# EAGLE design mainBoard (EAGLE 9.6.2)

## Sheet 1 of 6
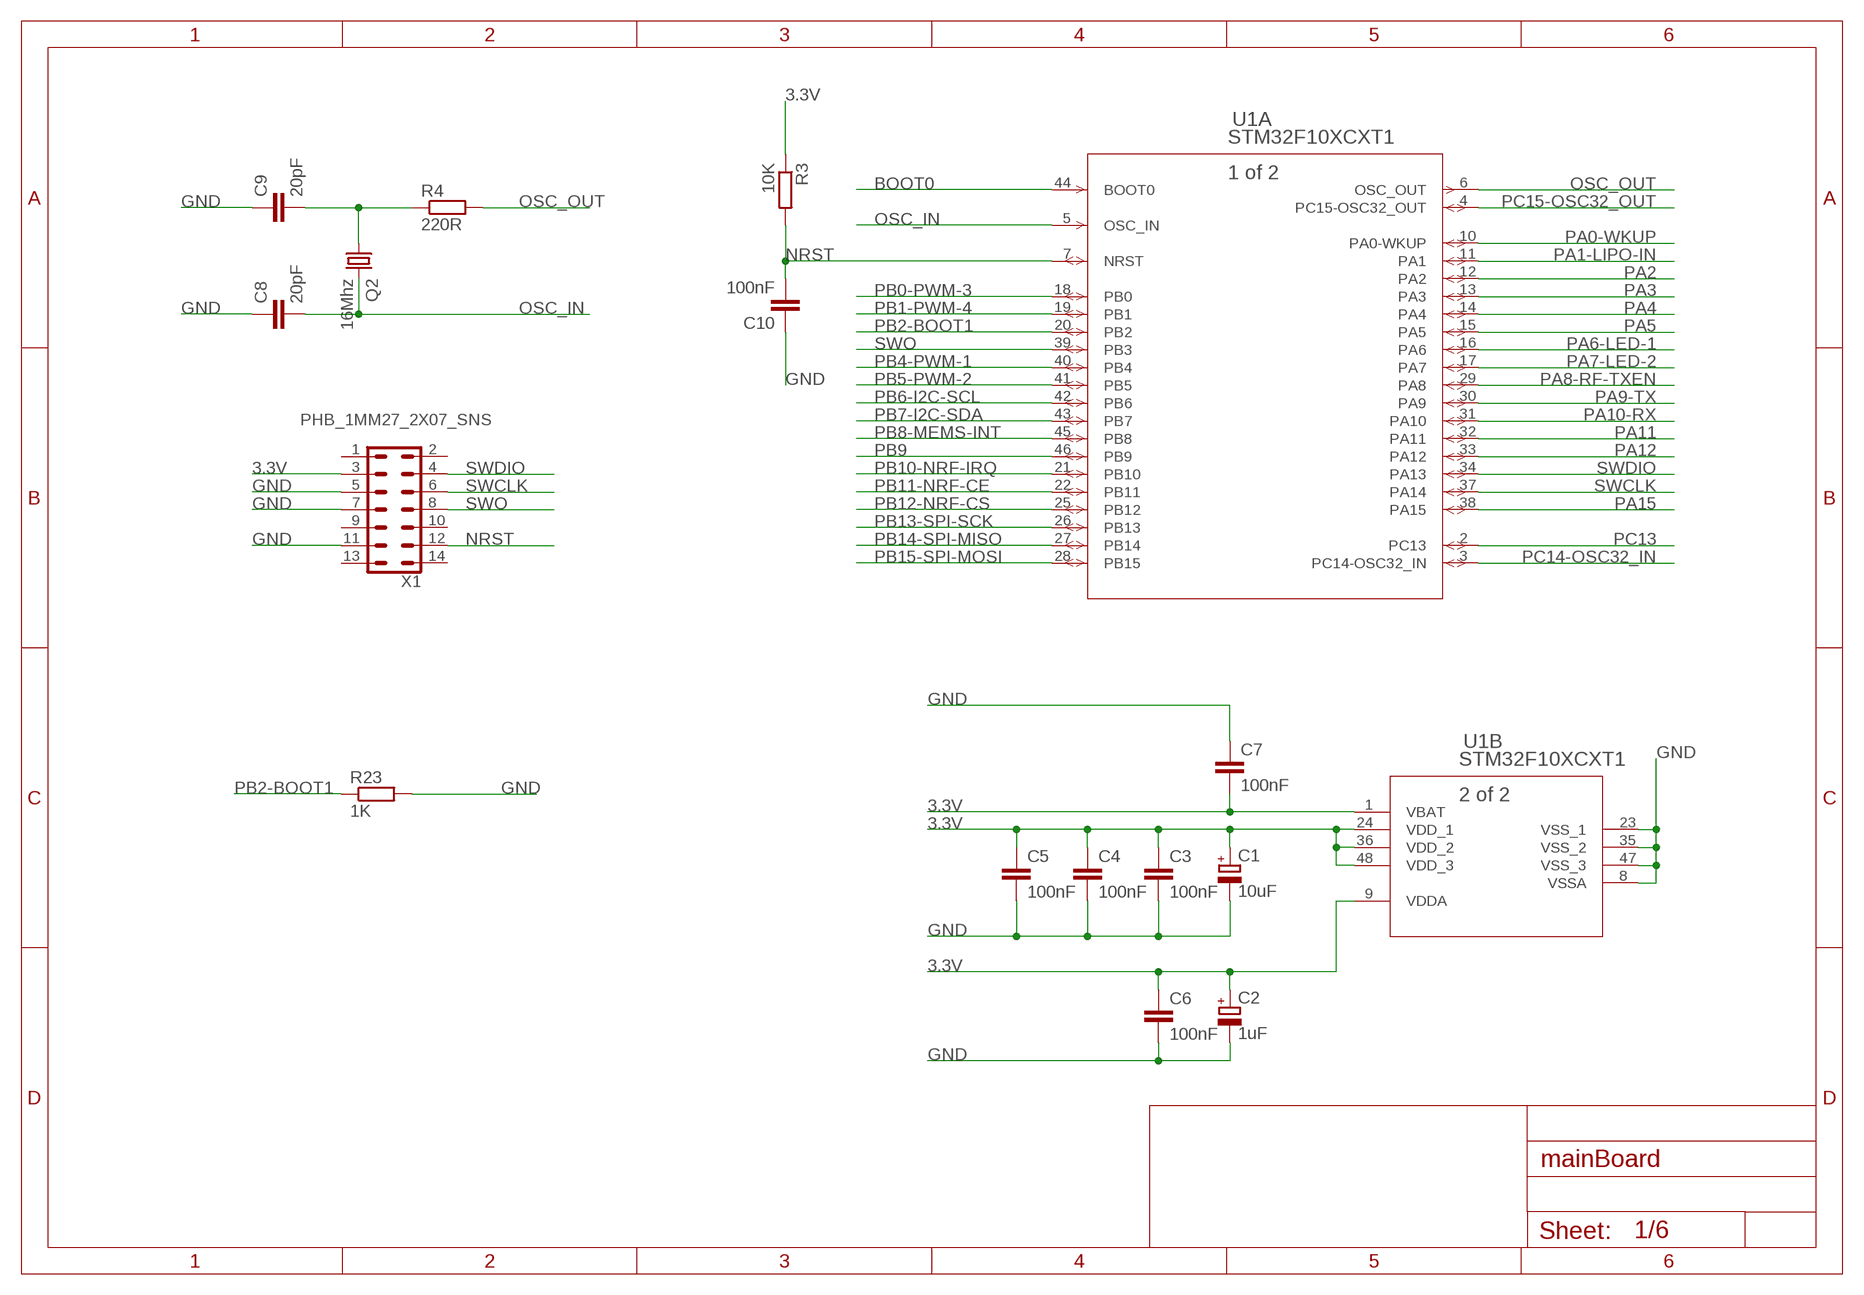
[diagram p0: schematic, sheet 1]

### Parts
C1  10uF  CPOL-EUSMCA  [SMC_A]
C2  1uF  CPOL-EUSMCA  [SMC_A]
C3  100nF  C-EUC0805  [C0805]
C4  100nF  C-EUC0805  [C0805]
C5  100nF  C-EUC0805  [C0805]
C6  100nF  C-EUC0805  [C0805]
C7  100nF  C-EUC0805  [C0805]
C8  20pF  C-EUC0805  [C0805]
C9  20pF  C-EUC0805  [C0805]
C10  100nF  C-EUC0805  [C0805]
Q2  16Mhz  CRYSTALHC49S  [HC49/S]
R3  10K  R-EU_R0805  [R0805]
R4  220R  R-EU_R0805  [R0805]
R23  1K  R-EU_R0805  [R0805]
U1  STM32F10XCXT1  [LQFP48-7X7MM]
X1  PHB_1MM27_2X07_SNS  [PHB_1MM27_2X07_SNS]

### Nets
3.3V: C1.+ C2.+ C3.1 C4.1 C5.1 C6.1 C7.2 R3.1 U1.1(B:VBAT) U1.9(B:VDDA) U1.24(B:VDD_1) U1.36(B:VDD_2) U1.48(B:VDD_3) X1.3 ; also sheet 2,3,4,5,6
BOOT0: U1.44(A:BOOT0) ; also sheet 2
GND: C1.- C2.- C3.2 C4.2 C5.2 C6.2 C7.1 C8.1 C9.1 C10.1 R23.2 U1.8(B:VSSA) U1.23(B:VSS_1) U1.35(B:VSS_2) U1.47(B:VSS_3) X1.5 X1.7 X1.11 ; also sheet 2,3,4,5,6
N$5: C9.2 Q2.1 R4.1
NRST: C10.2 R3.2 U1.7(A:NRST) X1.12 ; also sheet 2
OSC_IN: C8.2 Q2.2 U1.5(A:OSC_IN)
OSC_OUT: R4.2 U1.6(A:OSC_OUT)
PA0-WKUP: U1.10(A:PA0-WKUP)
PA1-LIPO-IN: U1.11(A:PA1) ; also sheet 6
PA2: U1.12(A:PA2)
PA3: U1.13(A:PA3)
PA4: U1.14(A:PA4)
PA5: U1.15(A:PA5)
PA6-LED-1: U1.16(A:PA6) ; also sheet 6
PA7-LED-2: U1.17(A:PA7) ; also sheet 6
PA8-RF-TXEN: U1.29(A:PA8) ; also sheet 3
PA9-TX: U1.30(A:PA9) ; also sheet 2
PA10-RX: U1.31(A:PA10) ; also sheet 2
PA11: U1.32(A:PA11)
PA12: U1.33(A:PA12)
PA15: U1.38(A:PA15)
PB0-PWM-3: U1.18(A:PB0) ; also sheet 6
PB1-PWM-4: U1.19(A:PB1) ; also sheet 6
PB2-BOOT1: R23.1 U1.20(A:PB2)
PB4-PWM-1: U1.40(A:PB4) ; also sheet 6
PB5-PWM-2: U1.41(A:PB5) ; also sheet 6
PB6-I2C-SCL: U1.42(A:PB6) ; also sheet 4,5
PB7-I2C-SDA: U1.43(A:PB7) ; also sheet 4,5
PB8-MEMS-INT: U1.45(A:PB8) ; also sheet 4
PB9: U1.46(A:PB9)
PB10-NRF-IRQ: U1.21(A:PB10) ; also sheet 3
PB11-NRF-CE: U1.22(A:PB11) ; also sheet 3
PB12-NRF-CS: U1.25(A:PB12) ; also sheet 3
PB13-SPI-SCK: U1.26(A:PB13) ; also sheet 3
PB14-SPI-MISO: U1.27(A:PB14) ; also sheet 3
PB15-SPI-MOSI: U1.28(A:PB15) ; also sheet 3
PC13: U1.2(A:PC13)
PC14-OSC32_IN: U1.3(A:PC14-OSC32_IN)
PC15-OSC32_OUT: U1.4(A:PC15-OSC32_OUT)
SWCLK: U1.37(A:PA14) X1.6
SWDIO: U1.34(A:PA13) X1.4
SWO: U1.39(A:PB3) X1.8
Unconnected: X1.1 X1.2 X1.9 X1.10 X1.13 X1.14

## Sheet 2 of 6
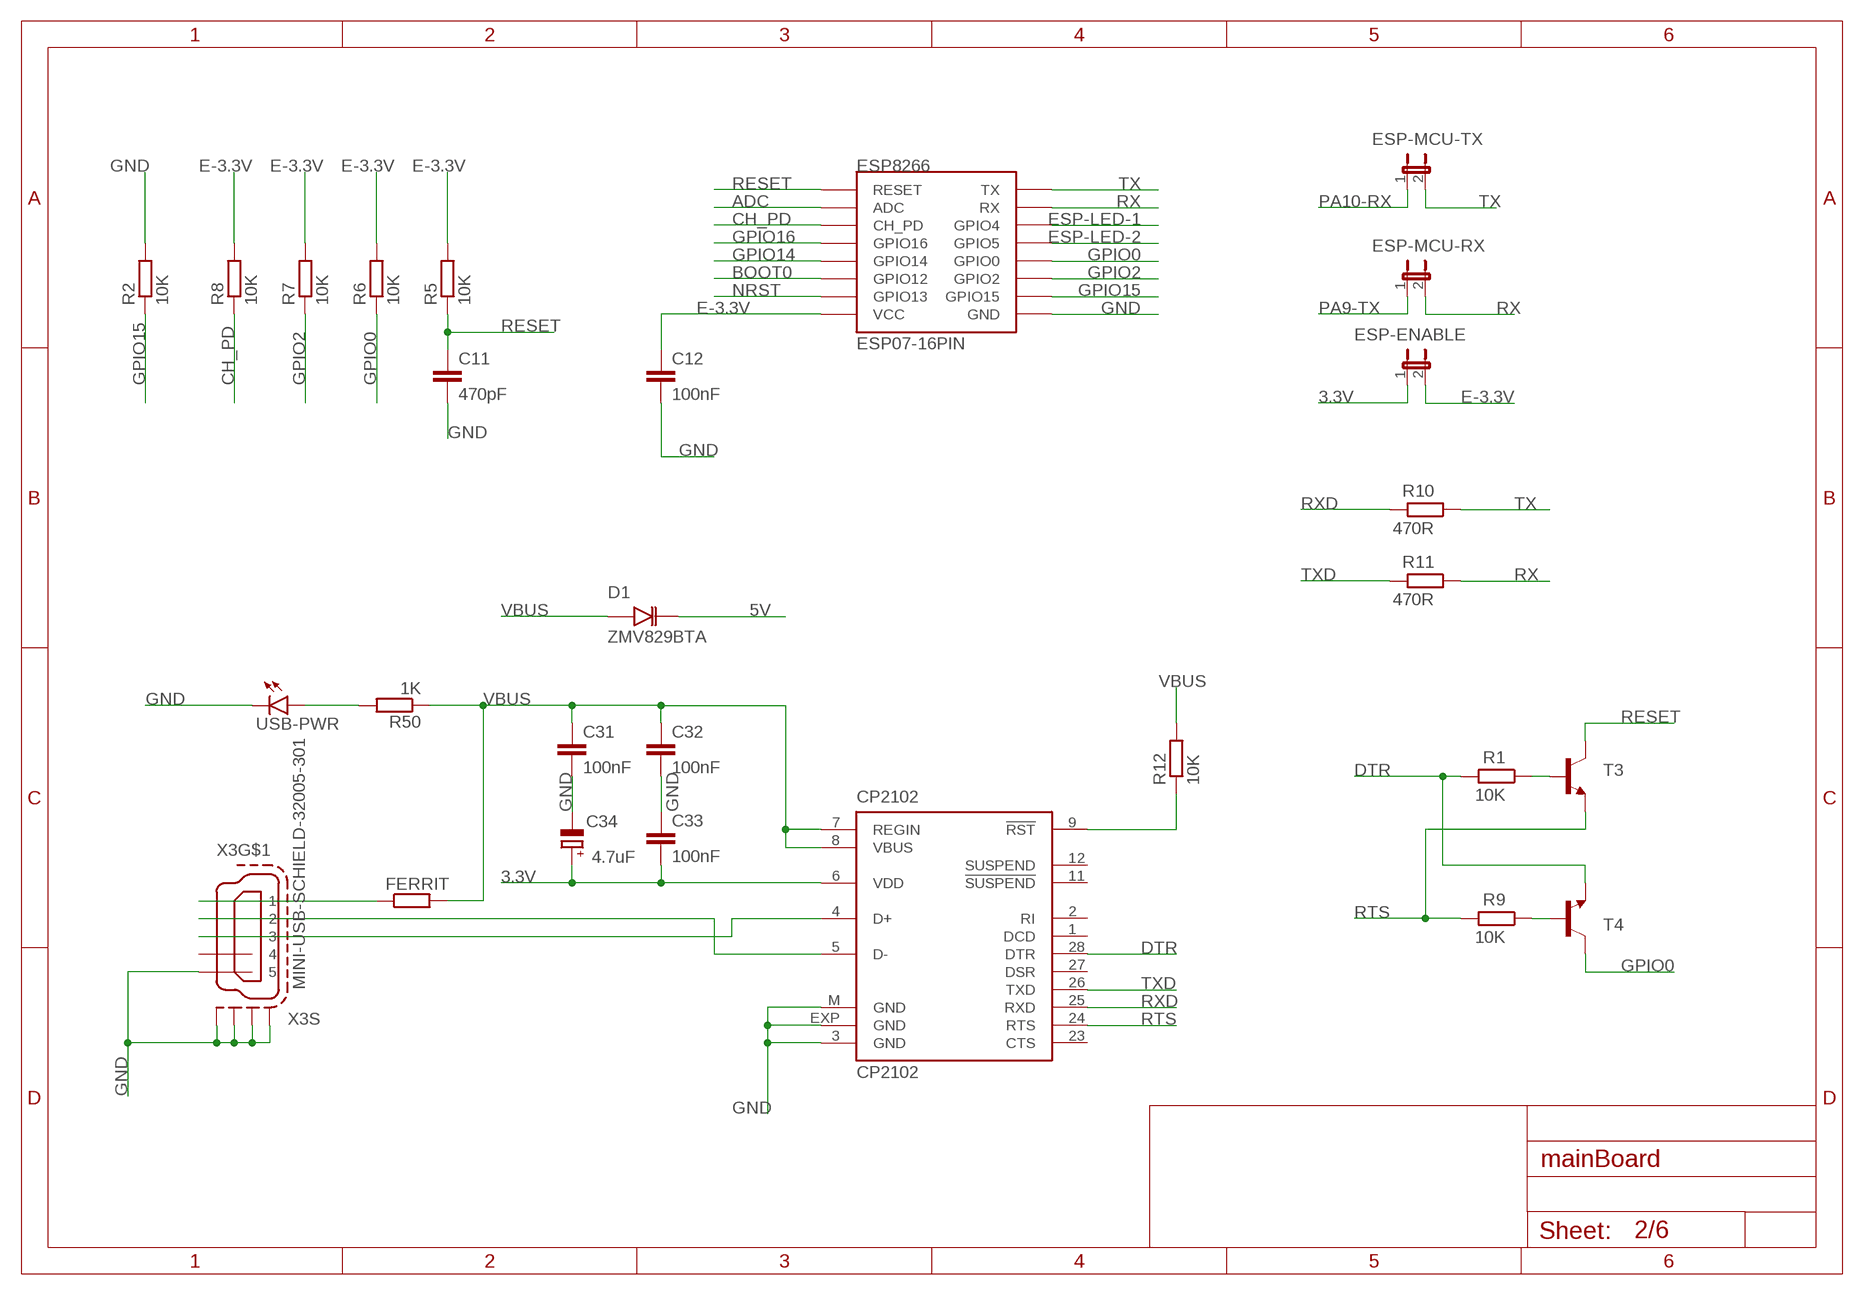
[diagram p1: schematic, sheet 2]

### Parts
C11  470pF  C-EUC0805  [C0805]
C12  100nF  C-EUC0805  [C0805]
C31  100nF  C-EUC0805  [C0805]
C32  100nF  C-EUC0805  [C0805]
C33  100nF  C-EUC0805  [C0805]
C34  4.7uF  CPOL-EUSMCA  [SMC_A]
CP2102  CP2102  [MLP28]
D1  ZMV829BTA  [SOD2512X116N]
ESP8266  ESP07-16PIN  [ESP07-16PIN]
ESP-ENABLE  JP1E  [JP1]
ESP-MCU-RX  JP1E  [JP1]
ESP-MCU-TX  JP1E  [JP1]
FERRIT  R-EU_R0805  [R0805]
R1  10K  R-EU_R0805  [R0805]
R2  10K  R-EU_R0805  [R0805]
R5  10K  R-EU_R0805  [R0805]
R6  10K  R-EU_R0805  [R0805]
R7  10K  R-EU_R0805  [R0805]
R8  10K  R-EU_R0805  [R0805]
R9  10K  R-EU_R0805  [R0805]
R10  470R  R-EU_R0805  [R0805]
R11  470R  R-EU_R0805  [R0805]
R12  10K  R-EU_R0805  [R0805]
R50  1K  R-EU_R0805  [R0805]
T3  -NPN-SOT23-EBC  [SOT23-EBC]
T4  -NPN-SOT23-EBC  [SOT23-EBC]
USB-PWR  LEDCHIPLED_0805  [CHIPLED_0805]
X3  MINI-USB-SCHIELD-32005-301  [32005-301]

### Nets
3.3V: C33.2 C34.+ CP2102.6(VDD) ESP-ENABLE.1 ; also sheet 1,3,4,5,6
5V: D1.K ; also sheet 6
ADC: ESP8266.ADC
BOOT0: ESP8266.GPIO12 ; also sheet 1
CH_PD: ESP8266.CH_PD R8.1
DTR: CP2102.28(DTR) R1.2 T4.E
E-3.3V: C12.1 ESP8266.VCC ESP-ENABLE.2 R5.2 R6.2 R7.2 R8.2
ESP-LED-1: ESP8266.GPIO4 ; also sheet 6
ESP-LED-2: ESP8266.GPIO5 ; also sheet 6
GND: C11.2 C12.2 C31.2 C32.2 C33.1 C34.- CP2102.3(GND) CP2102.EXP(GND) CP2102.M(GND) ESP8266.GND R2.2 USB-PWR.C X3.5 X3.M1(S:S1) X3.M2(S:S2) X3.M3(S:S3) X3.M4(S:S4) ; also sheet 1,3,4,5,6
GPIO0: ESP8266.GPIO0 R6.1 T4.C
GPIO2: ESP8266.GPIO2 R7.1
GPIO14: ESP8266.GPIO14
GPIO15: ESP8266.GPIO15 R2.1
GPIO16: ESP8266.GPIO16
N$1: CP2102.9(!RST) R12.1
N$2: CP2102.5(D-) X3.2
N$3: FERRIT.1 X3.1
N$4: CP2102.4(D+) X3.3
N$29: R1.1 T3.B
N$32: R9.1 T4.B
N$44: R50.2 USB-PWR.A
NRST: ESP8266.GPIO13 ; also sheet 1
PA9-TX: ESP-MCU-RX.1 ; also sheet 1
PA10-RX: ESP-MCU-TX.1 ; also sheet 1
RESET: C11.1 ESP8266.REST(RESET) R5.1 T3.C
RTS: CP2102.24(RTS) R9.2 T3.E
RX: ESP8266.RX ESP-MCU-RX.2 R11.1
RXD: CP2102.25(RXD) R10.2
TX: ESP8266.TX ESP-MCU-TX.2 R10.1
TXD: CP2102.26(TXD) R11.2
VBUS: C31.1 C32.1 CP2102.7(REGIN) CP2102.8(VBUS) D1.A FERRIT.2 R12.2 R50.1
Unconnected: CP2102.1(DCD) CP2102.2(RI) CP2102.11(!SUSPEND) CP2102.12(SUSPEND) CP2102.23(CTS) CP2102.27(DSR) X3.4

## Sheet 3 of 6
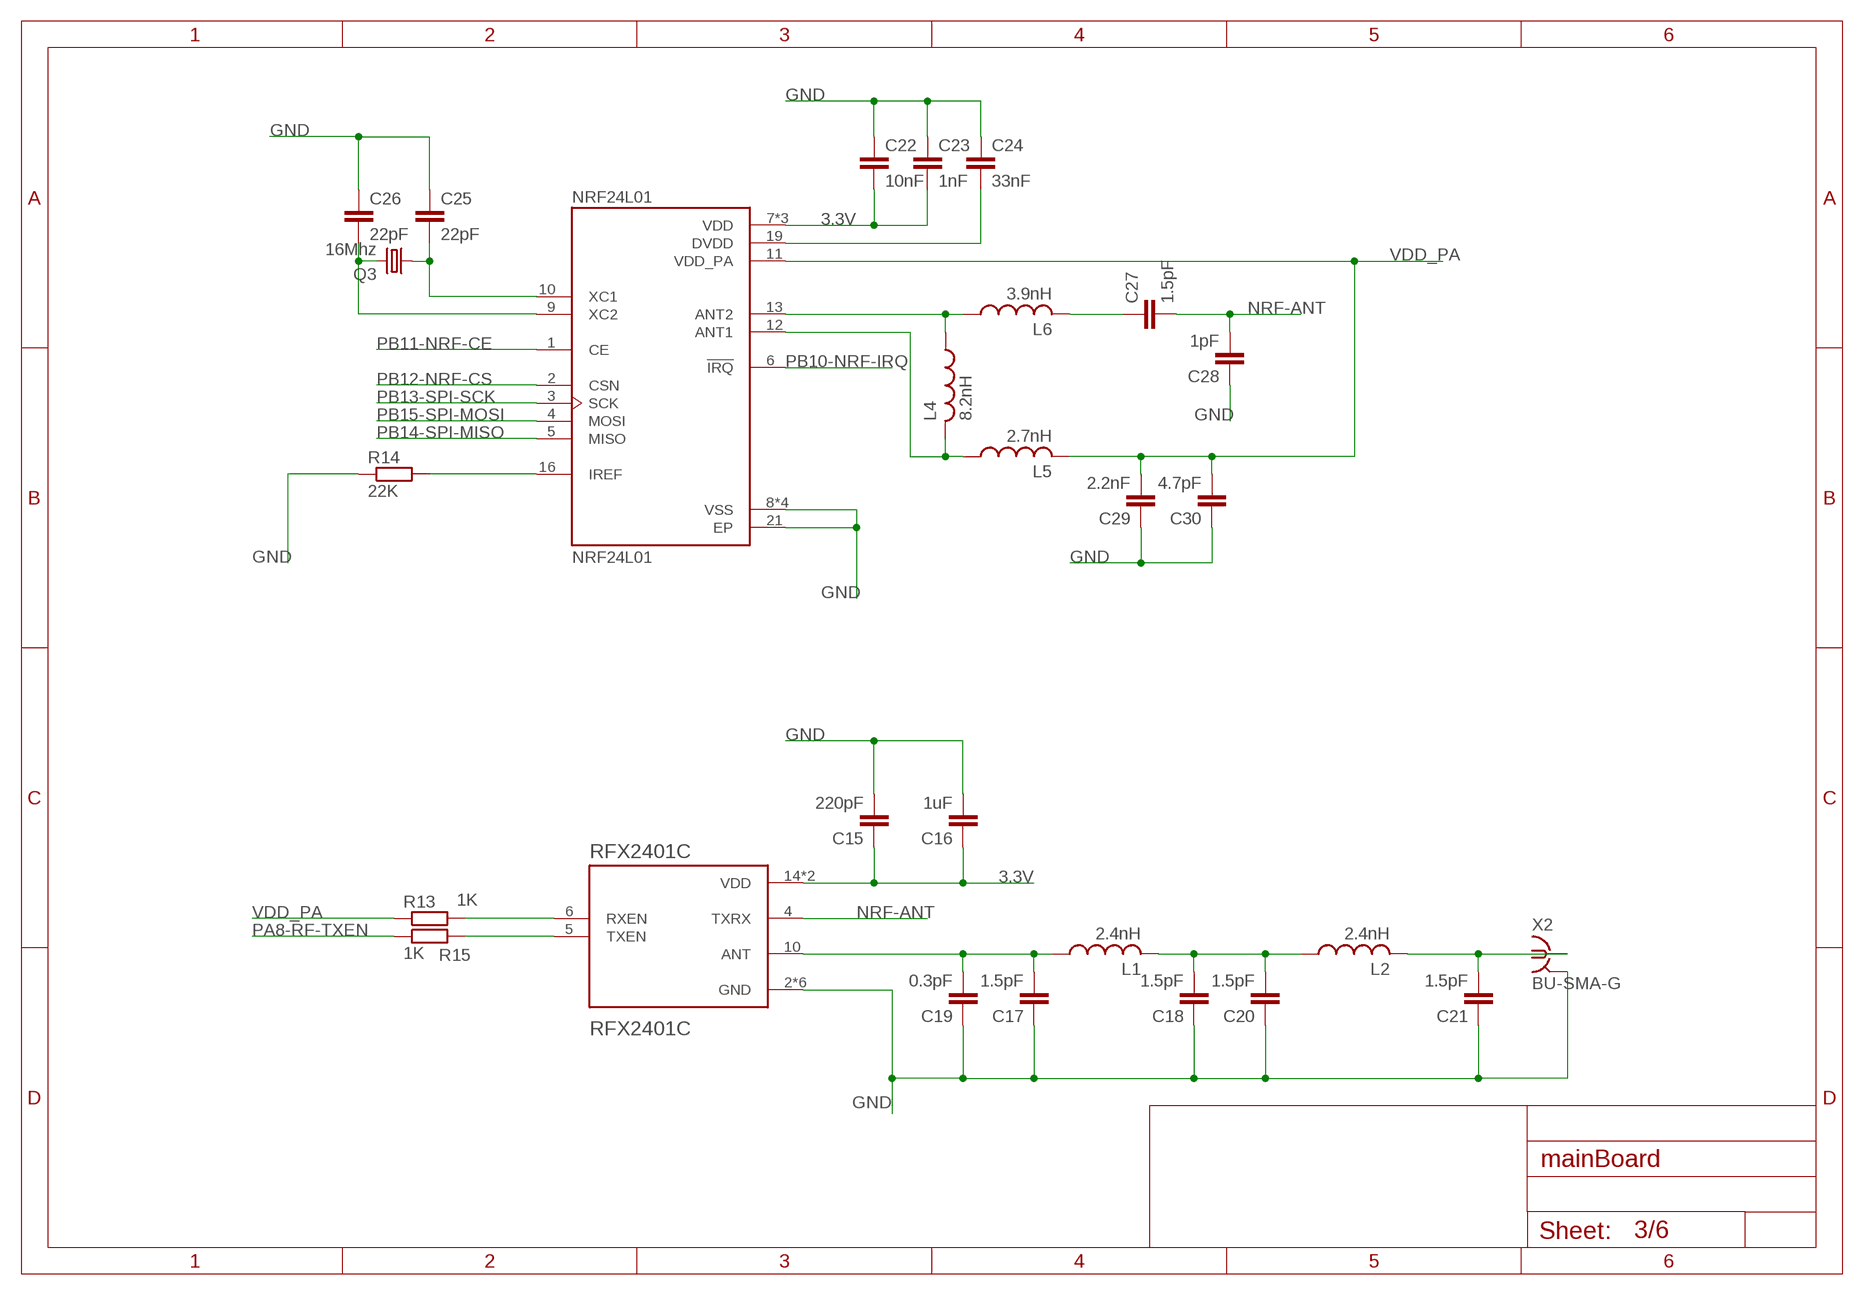
[diagram p2: schematic, sheet 3]

### Parts
C15  220pF  C-EUC0805  [C0805]
C16  1uF  C-EUC0805  [C0805]
C17  1.5pF  C-EUC0805  [C0805]
C18  1.5pF  C-EUC0805  [C0805]
C19  0.3pF  C-EUC0805  [C0805]
C20  1.5pF  C-EUC0805  [C0805]
C21  1.5pF  C-EUC0805  [C0805]
C22  10nF  C-EUC0805  [C0805]
C23  1nF  C-EUC0805  [C0805]
C24  33nF  C-EUC0805  [C0805]
C25  22pF  C-EUC0805  [C0805]
C26  22pF  C-EUC0805  [C0805]
C27  1.5pF  C-EUC0805  [C0805]
C28  1pF  C-EUC0805  [C0805]
C29  2.2nF  C-EUC0805  [C0805]
C30  4.7pF  C-EUC0805  [C0805]
L1  2.4nH  L-USL2012C  [L2012C]
L2  2.4nH  L-USL2012C  [L2012C]
L4  8.2nH  L-USL2012C  [L2012C]
L5  2.7nH  L-USL2012C  [L2012C]
L6  3.9nH  L-USL2012C  [L2012C]
NRF24L01  NRF24L01  [QFN50P400X400X95-21N]
Q3  16Mhz  CRYSTALHC49S  [HC49/S]
R13  1K  R-EU_R0805  [R0805]
R14  22K  R-EU_R0805  [R0805]
R15  1K  R-EU_R0805  [R0805]
RFX2401C  RFX2401C  [QFN50P300X300X60-17N]
X2  BU-SMA-G  [BU-SMA-G]

### Nets
3.3V: C15.1 C16.1 C22.2 C23.2 NRF24L01.7(VDD) NRF24L01.15(VDD) NRF24L01.18(VDD) RFX2401C.14(VDD) RFX2401C.16(VDD) ; also sheet 1,2,4,5,6
GND: C15.2 C16.2 C17.1 C18.1 C19.1 C20.1 C21.1 C22.1 C23.1 C24.1 C25.1 C26.1 C28.1 C29.1 C30.1 NRF24L01.8(VSS) NRF24L01.14(VSS) NRF24L01.17(VSS) NRF24L01.20(VSS) NRF24L01.21(EP) R14.1 RFX2401C.2(GND) RFX2401C.3(GND) RFX2401C.8(GND) RFX2401C.9(GND) RFX2401C.11(GND) RFX2401C.17(GND) X2.2 X2.3 X2.4 X2.5 ; also sheet 1,2,4,5,6
N$6: R13.2 RFX2401C.6(RXEN)
N$7: R15.2 RFX2401C.5(TXEN)
N$8: C17.2 C19.2 L1.1 RFX2401C.10(ANT)
N$9: C18.2 C20.2 L1.2 L2.1
N$10: C25.2 NRF24L01.10(XC1) Q3.1
N$11: C21.2 L2.2 X2.1
N$15: C26.2 NRF24L01.9(XC2) Q3.2
N$16: NRF24L01.16(IREF) R14.2
N$19: L4.1 L6.1 NRF24L01.13(ANT2)
N$20: L4.2 L5.1 NRF24L01.12(ANT1)
N$21: C27.1 L6.2
N$22: C24.2 NRF24L01.19(DVDD)
NRF-ANT: C27.2 C28.2 RFX2401C.4(TXRX)
PA8-RF-TXEN: R15.1 ; also sheet 1
PB10-NRF-IRQ: NRF24L01.6(!IRQ) ; also sheet 1
PB11-NRF-CE: NRF24L01.1(CE) ; also sheet 1
PB12-NRF-CS: NRF24L01.2(CSN) ; also sheet 1
PB13-SPI-SCK: NRF24L01.3(SCK) ; also sheet 1
PB14-SPI-MISO: NRF24L01.5(MISO) ; also sheet 1
PB15-SPI-MOSI: NRF24L01.4(MOSI) ; also sheet 1
VDD_PA: C29.2 C30.2 L5.2 NRF24L01.11(VDD_PA) R13.1

## Sheet 4 of 6
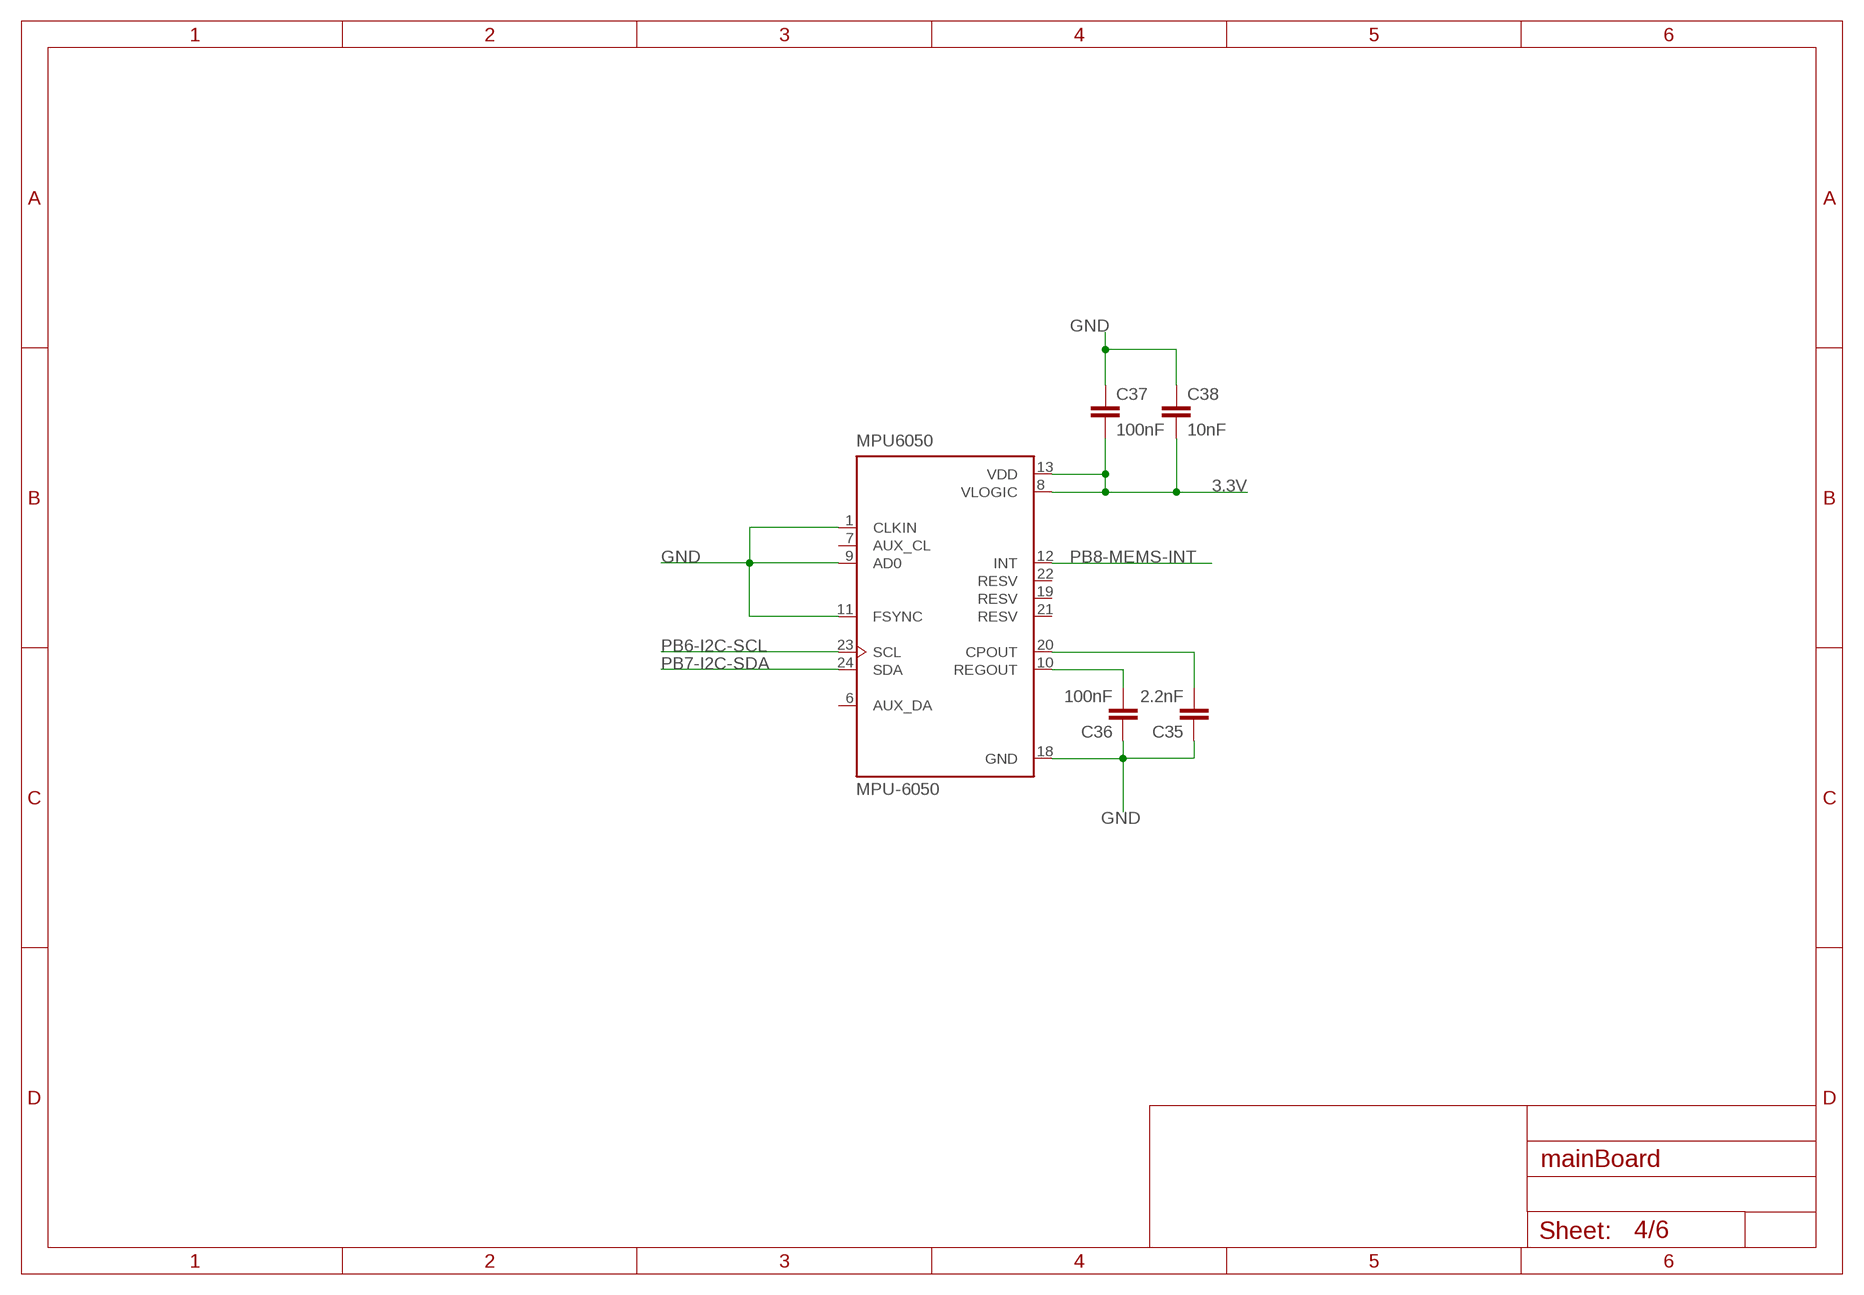
[diagram p3: schematic, sheet 4]

### Parts
C35  2.2nF  C-EUC0805  [C0805]
C36  100nF  C-EUC0805  [C0805]
C37  100nF  C-EUC0805  [C0805]
C38  10nF  C-EUC0805  [C0805]
MPU6050  MPU-6050  [QFN50P400X400X95-24N]

### Nets
3.3V: C37.2 C38.2 MPU6050.8(VLOGIC) MPU6050.13(VDD) ; also sheet 1,2,3,5,6
GND: C35.1 C36.1 C37.1 C38.1 MPU6050.1(CLKIN) MPU6050.9(AD0) MPU6050.11(FSYNC) MPU6050.18(GND) ; also sheet 1,2,3,5,6
N$26: C36.2 MPU6050.10(REGOUT)
N$27: C35.2 MPU6050.20(CPOUT)
PB6-I2C-SCL: MPU6050.23(SCL) ; also sheet 1,5
PB7-I2C-SDA: MPU6050.24(SDA) ; also sheet 1,5
PB8-MEMS-INT: MPU6050.12(INT) ; also sheet 1
Unconnected: MPU6050.6(AUX_DA) MPU6050.7(AUX_CL) MPU6050.19(RESV) MPU6050.21(RESV) MPU6050.22(RESV)

## Sheet 5 of 6
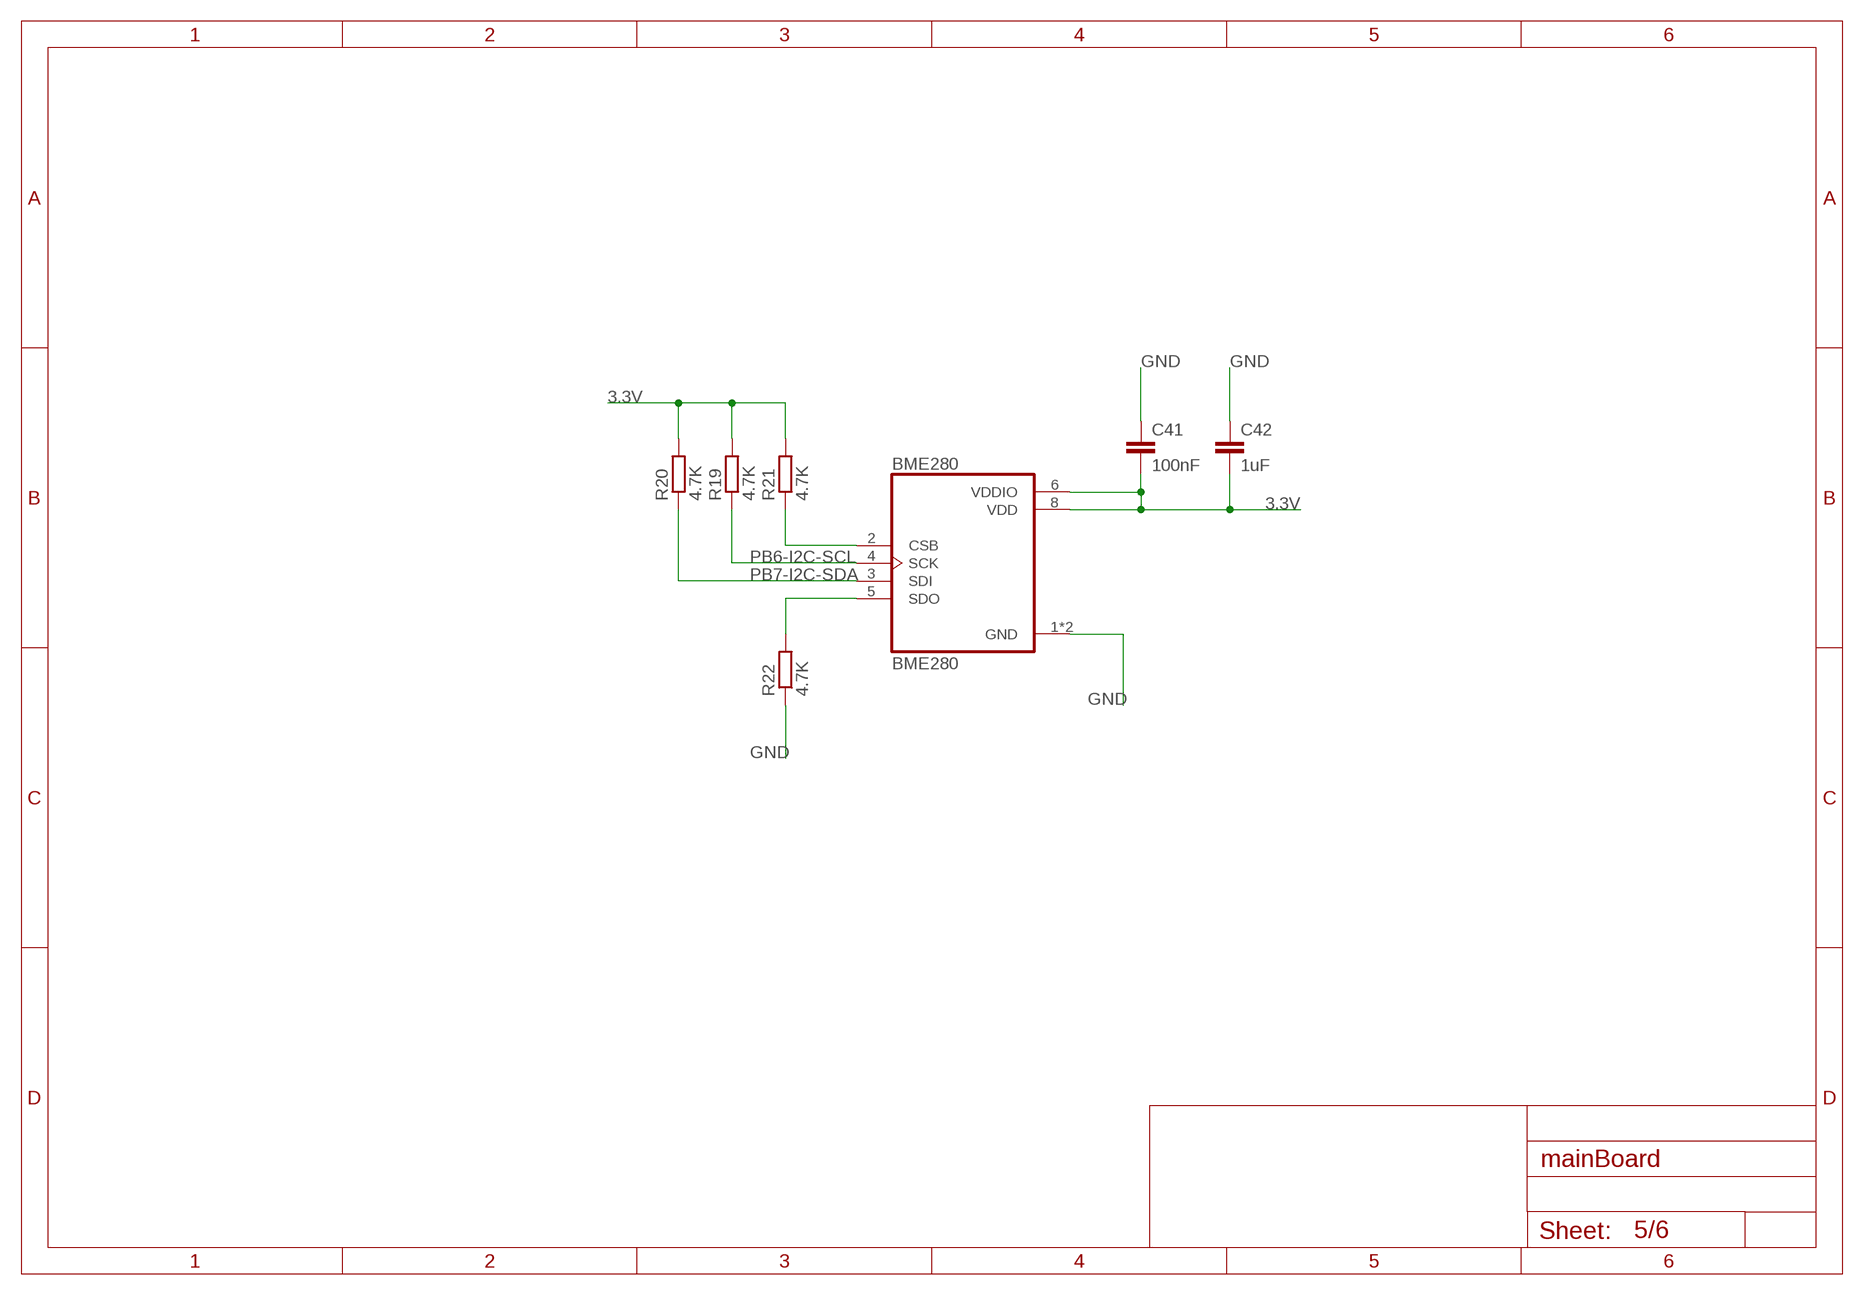
[diagram p4: schematic, sheet 5]

### Parts
BME280  BME280  [PSON65P250X250X100-8N]
C41  100nF  C-EUC0805  [C0805]
C42  1uF  C-EUC0805  [C0805]
R19  4.7K  R-EU_R0805  [R0805]
R20  4.7K  R-EU_R0805  [R0805]
R21  4.7K  R-EU_R0805  [R0805]
R22  4.7K  R-EU_R0805  [R0805]

### Nets
3.3V: BME280.6(VDDIO) BME280.8(VDD) C41.2 C42.2 R19.2 R20.2 R21.2 ; also sheet 1,2,3,4,6
GND: BME280.1(GND) BME280.7(GND) C41.1 C42.1 R22.1 ; also sheet 1,2,3,4,6
N$30: BME280.2(CSB) R21.1
N$31: BME280.5(SDO) R22.2
PB6-I2C-SCL: BME280.4(SCK) R19.1 ; also sheet 1,4
PB7-I2C-SDA: BME280.3(SDI) R20.1 ; also sheet 1,4

## Sheet 6 of 6
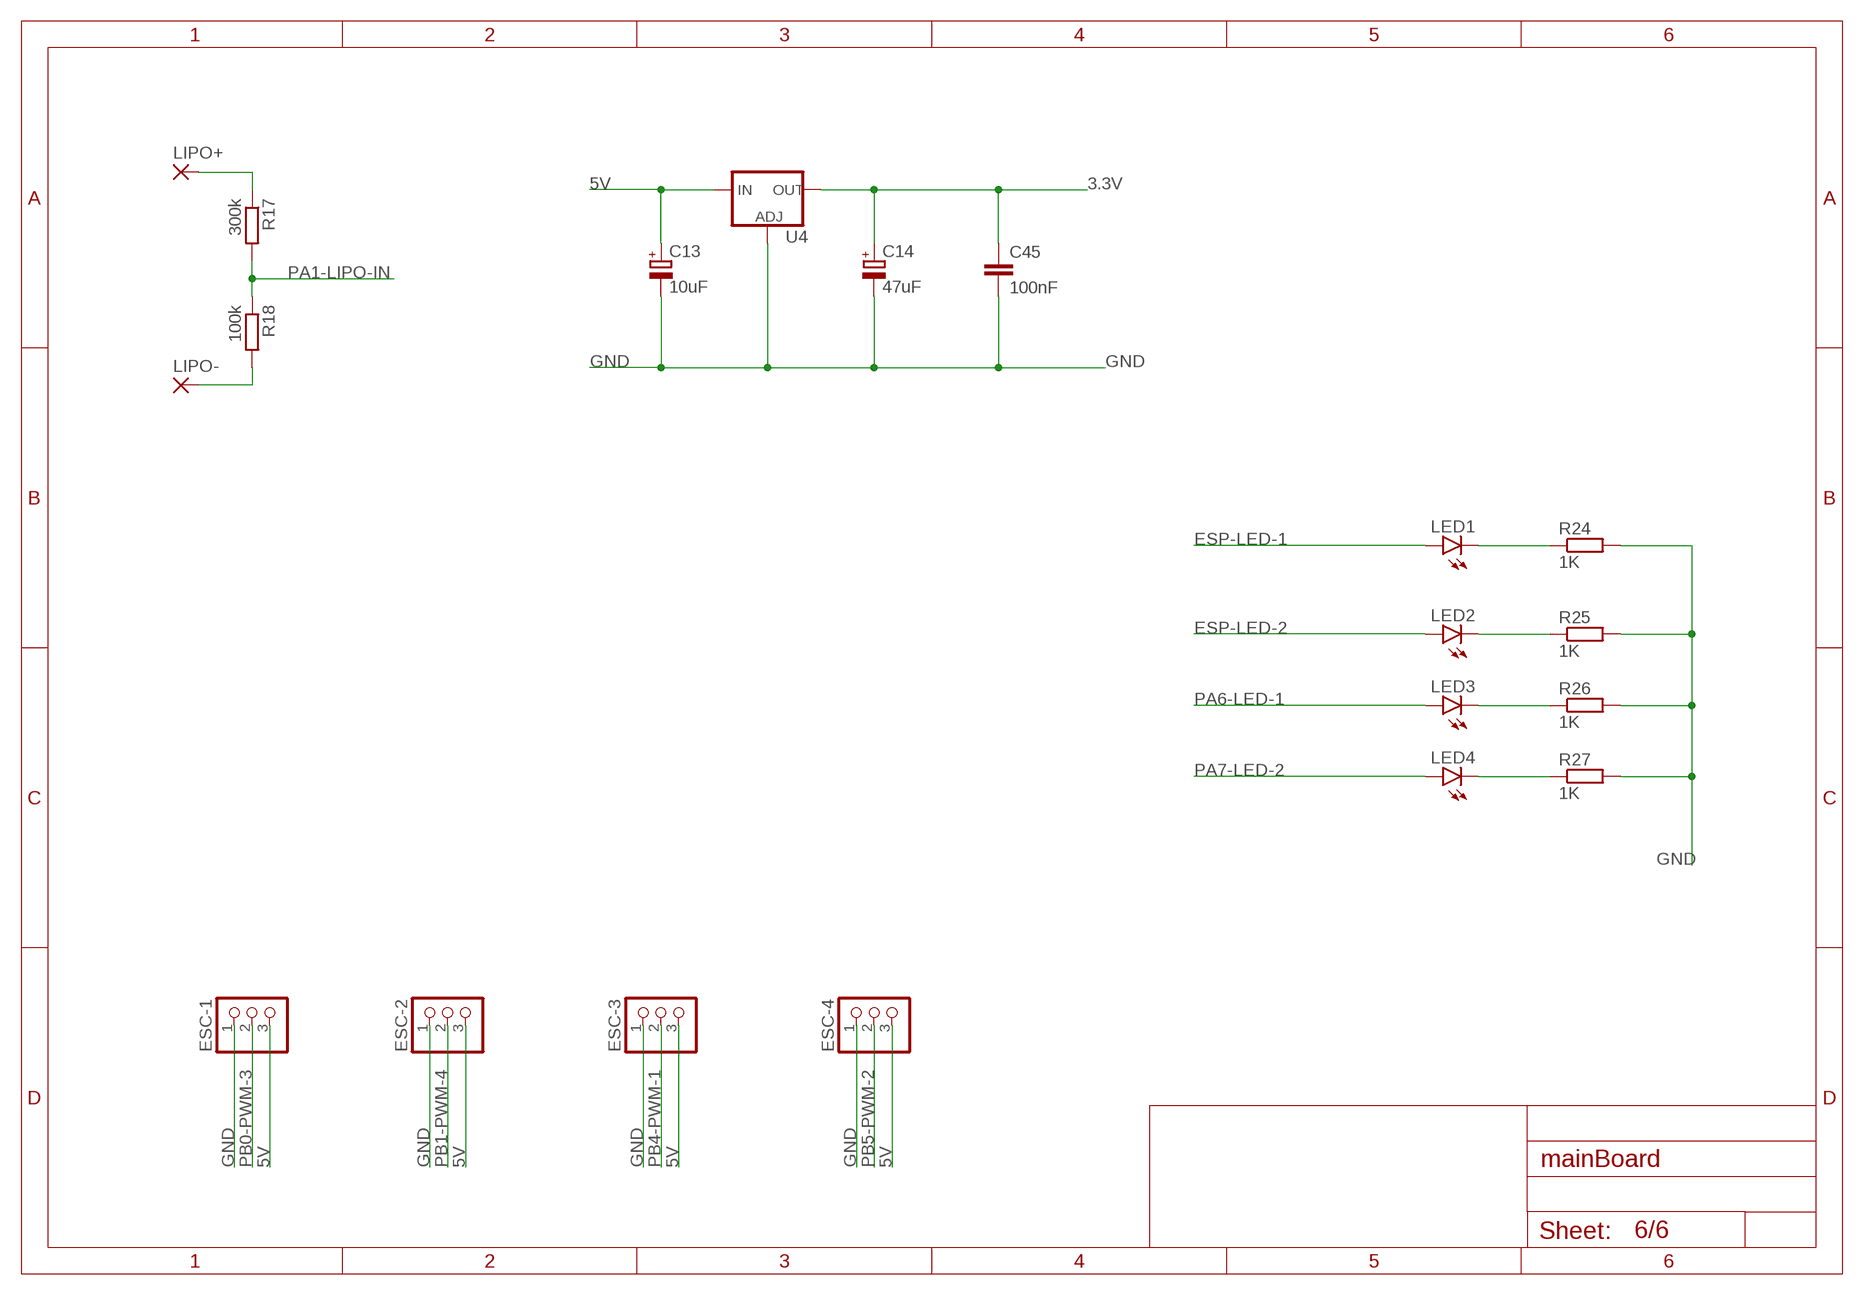
[diagram p5: schematic, sheet 6]

### Parts
C13  10uF  CPOL-EUSMCA  [SMC_A]
C14  47uF  CPOL-EUSMCA  [SMC_A]
C45  100nF  C-EUC0805  [C0805]
ESC-1  PINHD-1X3  [1X03]
ESC-2  PINHD-1X3  [1X03]
ESC-3  PINHD-1X3  [1X03]
ESC-4  PINHD-1X3  [1X03]
LED1  LEDCHIPLED_0805  [CHIPLED_0805]
LED2  LEDCHIPLED_0805  [CHIPLED_0805]
LED3  LEDCHIPLED_0805  [CHIPLED_0805]
LED4  LEDCHIPLED_0805  [CHIPLED_0805]
LIPO+  2,15/1,0  [2,15/1,0]
LIPO-  2,15/1,0  [2,15/1,0]
R17  300k  R-EU_R0805  [R0805]
R18  100k  R-EU_R0805  [R0805]
R24  1K  R-EU_R0805  [R0805]
R25  1K  R-EU_R0805  [R0805]
R26  1K  R-EU_R0805  [R0805]
R27  1K  R-EU_R0805  [R0805]
U4  V_REG_LM1117SOT223  [SOT223]

### Nets
3.3V: C14.+ C45.1 U4.2(OUT) U4.4(OUT) ; also sheet 1,2,3,4,5
5V: C13.+ ESC-1.3 ESC-2.3 ESC-3.3 ESC-4.3 U4.3(IN) ; also sheet 2
ESP-LED-1: LED1.A ; also sheet 2
ESP-LED-2: LED2.A ; also sheet 2
GND: C13.- C14.- C45.2 ESC-1.1 ESC-2.1 ESC-3.1 ESC-4.1 R24.2 R25.2 R26.2 R27.2 U4.1(ADJ) ; also sheet 1,2,3,4,5
N$12: LIPO+.1(P) R17.1
N$13: LIPO-.1(P) R18.2
N$14: LED1.C R24.1
N$17: LED2.C R25.1
N$23: LED3.C R26.1
N$24: LED4.C R27.1
PA1-LIPO-IN: R17.2 R18.1 ; also sheet 1
PA6-LED-1: LED3.A ; also sheet 1
PA7-LED-2: LED4.A ; also sheet 1
PB0-PWM-3: ESC-1.2 ; also sheet 1
PB1-PWM-4: ESC-2.2 ; also sheet 1
PB4-PWM-1: ESC-3.2 ; also sheet 1
PB5-PWM-2: ESC-4.2 ; also sheet 1

## Library data of the parts
BME280 = BME280:BME280: DIGITAL HUMIDITY, PRESSURE AND TEMPERATURE SENSOR * Digital interface I²C (up to 3.4 MHz) and SPI (3 and 4 wire, up to 10 MHz)* Supply voltage VDD main supply voltage range: 1.71 V to 3.6 V*VDDIO interface voltage range: 1.2 V to 3.6 V Operating range -40…+85 °C, 0…100 % rel. humidity, 300…1100 hPa The library has been designed by Richard Magdycz <https://www.facebook.com/groups/eaglecadsoftUK> Check prices <https://pricing.snapeda.com/parts/BME280/Bosch/view-part?ref=eda>; AVAILABILITY: Good; DESCRIPTION: Humidity Temperature Sensor 0 ~ 100% RH I²C, SPI ±3% 1s Surface Mount; MF: Bosch; MP: BME280; PACKAGE: LGA-8 Bosch; PRICE: None; PURCHASE-URL: https://pricing.snapeda.com/search/part/BME280/?ref=eda
C1 C2 C13 C14 C34 = rcl:CPOL-EU: POLARIZED CAPACITOR, European symbol; SPICEPREFIX: C
C3-C12 C15-C33 C35-C38 C41 C42 C45 = rcl:C-EU: CAPACITOR, European symbol; SPICEPREFIX: C
CP2102 = silabs:CP210*: Single-Chip USB to UART Bridge Source: www.silabs.com .. CP2101.pdf / cp2102.pdf; MF: FARNELL; MPN: CP2102-GM; OC_FARNELL: 9282130; OC_NEWARK: 30K5635
D1 = ZMV829BTA:ZMV829BTA: Varactors Single 25V Surface Mount SOD-323 Check prices <https://pricing.snapeda.com/search/part/ZMV829BTA/?ref=eda>; AVAILABILITY: Bad; DESCRIPTION: Varactors Single 25V Surface Mount SOD-323; MF: Diodes Inc.; MP: ZMV829BTA; PACKAGE: SOD-323 Diodes Inc.; PRICE: None
ESC-1-ESC-4 = pinhead:PINHD-1X3: PIN HEADER
ESP8266 = esp8266modules:ESP07-16PIN: ESP8266 Wifi module 07 - 16 pins; DIMENSIONS: 22.0 x 16.0 mm; PINS: 16; PITCH: 0.078" / 2 mm
ESP-ENABLE ESP-MCU-RX ESP-MCU-TX = jumper:JP1E: JUMPER
FERRIT R1-R15 R17-R27 R50 = rcl:R-EU_: RESISTOR, European symbol; SPICEPREFIX: R
L1 L2 L4-L6 = rcl:L-US: INDUCTOR, American symbol; SPICEPREFIX: L
LED1-LED4 USB-PWR = led:LED: LED OSRAM: - CHIPLED LG R971, LG N971, LY N971, LG Q971, LY Q971, LO R971, LY R971 LH N974, LH R974 LS Q976, LO Q976, LY Q976 LO Q996 - Hyper CHIPLED LW Q18S LB Q993, LB Q99A, LB R99A - SideLED LS A670, LO A670, LY A670, LG A670, LP A670 LB A673, LV A673, LT A673, LW A673 LH A674 LY A675 LS A676, LA A676, LO A676, LY A676, LW A676 LS A679, LY A679, LG A679 - Hyper Micro SIDELED® LS Y876, LA Y876, LO Y876, LY Y876 LT Y87S - SmartLED LW L88C, LW L88S LB L89C, LB L89S, LG L890 LS L89K, LO L89K, LY L89K LS L896, LA L896, LO L896, LY L896 - TOPLED LS T670, LO T670, LY T670, LG T670, LP T670 LSG T670, LSP T670, LSY T670, LOP T670, LYG T670 LG T671, LOG T671, LSG T671 LB T673, LV T673, LT T673, LW T673 LH T674 LS T676, LA T676, LO T676, LY T676, LB T676, LH T676, LSB T676, LW T676 LB T67C, LV T67C, LT T67C, LS T67K, LO T67K, LY T67K, LW E67C LS E67B, LA E67B, LO E67B, LY E67B, LB E67C, LV E67C, LT E67C LW T67C LS T679, LY T679, LG T679 LS T770, LO T770, LY T770, LG T770, LP T770 LB T773, LV T773, LT T773, LW T773 LH T774 LS E675, LA E675, LY E675, LS T675 LS T776, LA T776, LO T776, LY T776, LB T776 LHGB T686 LT T68C, LB T68C - Hyper Mini TOPLED® LB M676 - Mini TOPLED Santana® LG M470 LS M47K, LO M47K, LY M47K Source: http://www.osram.convergy.de LUXEON: - LUMILED® LXK2-PW12-R00, LXK2-PW12-S00, LXK2-PW14-U00, LXK2-PW14-V00 LXK2-PM12-R00, LXK2-PM12-S00, LXK2-PM14-U00 LXK2-PE12-Q00, LXK2-PE12-R00, LXK2-PE12-S00, LXK2-PE14-T00, LXK2-PE14-U00 LXK2-PB12-K00, LXK2-PB12-L00, LXK2-PB12-M00, LXK2-PB14-N00, LXK2-PB14-P00, LXK2-PB14-Q00 LXK2-PR12-L00, LXK2-PR12-M00, LXK2-PR14-Q00, LXK2-PR14-R00 LXK2-PD12-Q00, LXK2-PD12-R00, LXK2-PD12-S00 LXK2-PH12-R00, LXK2-PH12-S00 LXK2-PL12-P00, LXK2-PL12-Q00, LXK2-PL12-R00 Source: www.luxeon.com KINGBRIGHT: KA-3528ASYC Source: www.kingbright.com
LIPO+ LIPO- = wirepad:2,15/1,0: THROUGH-HOLE PAD
MPU6050 = MPU-6050:MPU-6050: MPU-6050 Six-Axis (Gyro + Accelerometer) MEMS MotionTracking™ Devices Check prices <https://pricing.snapeda.com/parts/MPU-6050/TDK%20InvenSense/view-part?ref=eda>; AVAILABILITY: Warning; DESCRIPTION: Accelerometer, Gyroscope, 6 Axis Sensor I²C Output; MF: TDK InvenSense; MP: MPU-6050; PACKAGE: VFQFN-24 TDK InvenSense; PRICE: None; PURCHASE-URL: https://pricing.snapeda.com/search/part/MPU-6050/?ref=eda
NRF24L01 = NRF24L01:NRF24L01: The nRF24L01 is a single chip 2.4GHz transceiver with an embedded baseband protocol engine (Enhanced ShockBurst™), designed for ultra low power wireless applications. The nRF24L01 is designed for operation in the world wide ISM frequency band at 2.400 - 2.4835GHz. An MCU (microcontroller) and very few external passive components are needed to design a radio system with the nRF24L01. The nRF24L01 is configured and operated through a Serial Peripheral Interface (SPI.) Through this interface the register map is available. The register map contains all configuration registers in the nRF24L01 and is accessible in all operation modes of the chip. Buy Part <https://snapeda.com/parts/NRF24L01/Nordic/view-part/?ref=eda>; AVAILABILITY: Warning; DESCRIPTION: IC RF TxRx Only General ISM > 1GHZ 2.4GHz 20-VFQFN Exposed Pad; MF: Nordic; MOUSER-PURCHASE-URL: https://snapeda.com/shop?store=Mouser&id=44833; MP: NRF24L01; PACKAGE: VFQFN-20 Nordic Semiconductor; PRICE: None
Q2 Q3 = crystal:CRYSTAL: CRYSTAL; OC_FARNELL: 1667008; OC_NEWARK: unknown
RFX2401C = RFX2401C:RFX2401C: None Check prices <https://pricing.snapeda.com/parts/RFX2401C/Skyworks%20Solutions/view-part?ref=eda>; AVAILABILITY: Bad; DESCRIPTION: RF Front End 2.4GHz ~ 2.5GHz 802.15.4, Zigbee® 16-QFN (3x3); MF: Skyworks Solutions; MP: RFX2401C; PACKAGE: UFQFN-16 Skyworks Solutions; PRICE: None; PURCHASE-URL: https://pricing.snapeda.com/search/part/RFX2401C/?ref=eda
T3 T4 = transistor:*-NPN-: NPN Transistror BF959 corrected 2008.03.06
U1 = STM32F10XCXT1:STM32F10XCXT1; COPYRIGHT: Copyright (C) 2016 Accelerated Designs. All rights reserved; MANUFACTURER_PART_NUMBER: STM32F10XCXT1; VENDOR: STMicroelectronics
U4 = SparkFun-IC-Power:V_REG_LM1117: Voltage Regulator LM1117 Standard adjustable voltage regulator but in SMD form. Spark Fun Electronics SKU : COM-00595; PROD_ID: VREG-08170
X1 = pinhead-box-1.27mm:PHB_1MM27_2X07_*: Pin Header Box-Type, 1.27mm/0.5"/50mil Pitch, 2x07 Circuits Note: see library description for an important note about THT-version
X2 = con-coax:BU-SMA-G: FEMALE SMA CONNECTOR Radiall distributor RS 193-9117; OC_FARNELL: unknown; OC_NEWARK: unknown
X3 = con-cypressindustries:MINI-USB-SCHIELD-: MINI USB-B Conector Source: www.cypressindustries.com; OC_FARNELL: unknown; OC_NEWARK: unknown

## Board
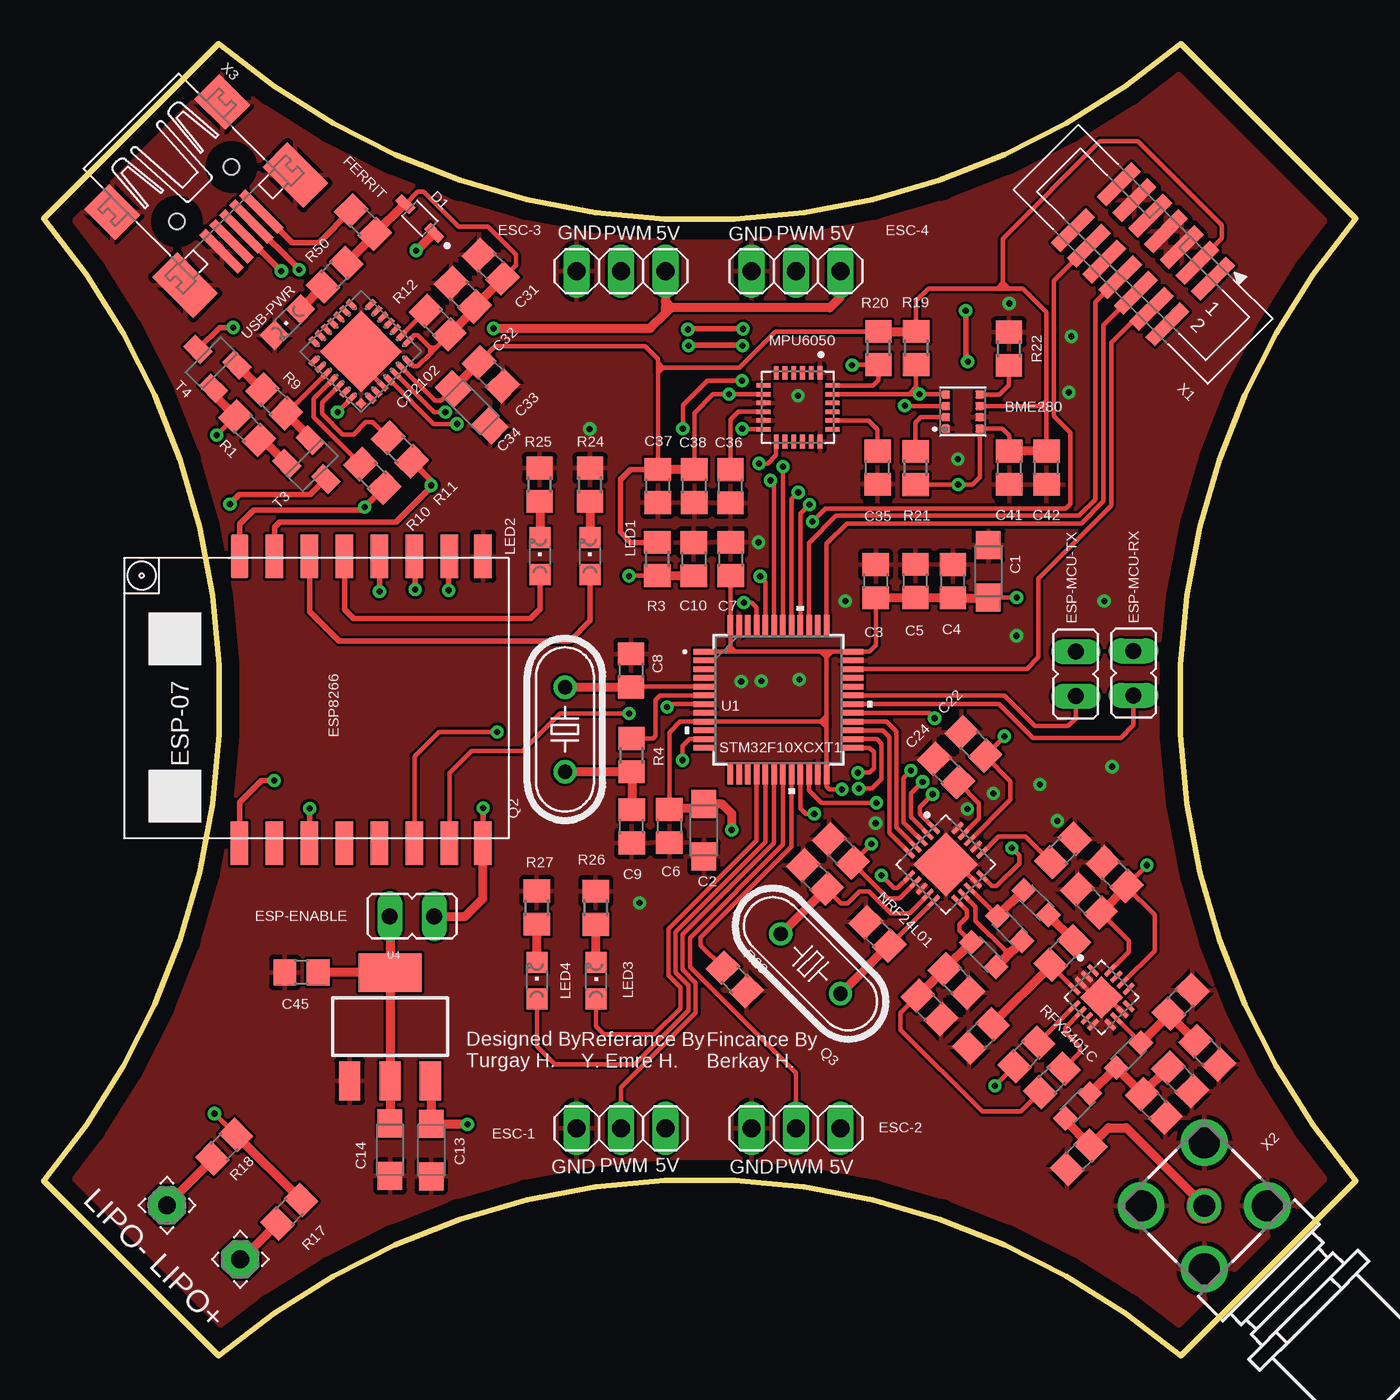
[diagram p6: board, top side]
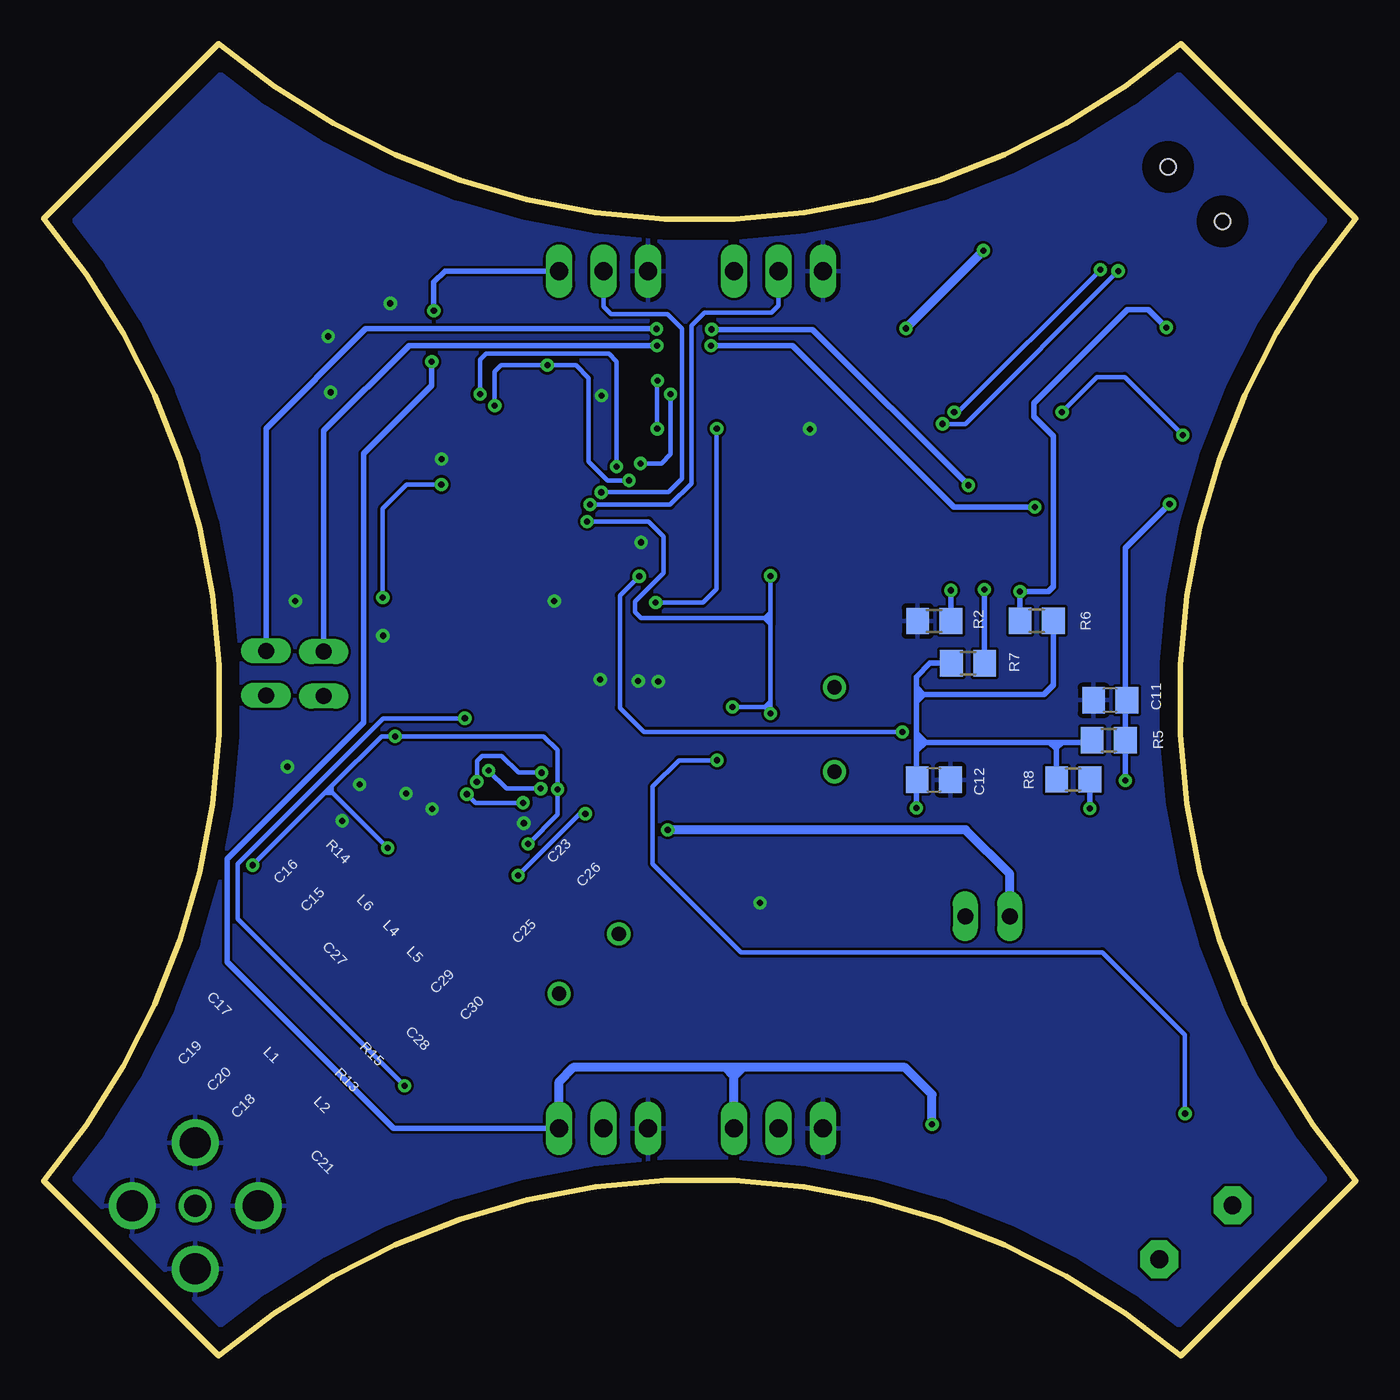
[diagram p7: board, bottom side, seen from below]

Size 75 x 75 mm. Coordinates in mm from the lower left corner, seen from the top.
Outline: 0,10 10,0 arc-80 65,0 75,10 arc-80 75,65 65,75 arc-80 10,75 0,65 arc-80 0,10
Copper layers (1*16): Top 0.035mm / dielectric 1.5mm / Bottom 0.035mm
Design rules "default": minimum track width 6mil, minimum drill 0.35mm, track to track 6mil, track to pad 6mil, pad to pad 6mil, via to via 6mil, smd to smd 6mil, copper to edge 40mil, drill to drill 6mil, minimum pad ring 10mil, minimum via ring 8mil, stop-mask expansion 4mil, vias tented up to drill 0mil, thermal gap 10mil

### Footprints (pad centres in the part's own frame; a part is rotated, then mirrored left to right if it is on the bottom)
PSON65P250X250X100-8N = smd 0.49 x 0.45: 1 0.97,0.975; 2 0.97,0.325; 3 0.97,-0.325; 4 0.97,-0.975; 5 -0.97,-0.975; 6 -0.97,-0.325; 7 -0.97,0.325; 8 -0.97,0.975
SMC_A = smd 1.6 x 1.4: + -1.5,0; - 1.5,0
C0805 = smd 1.3 x 1.5: 1 -0.95,0; 2 0.95,0
MLP28 = smd 0.6 x 0.3: 1 -2.3,1.5; 2 -2.3,1; 3 -2.3,0.5; 4 -2.3,0; 5 -2.3,-0.5; 6 -2.3,-1; 7 -2.3,-1.5; 15 2.3,-1.5; 16 2.3,-1; 17 2.3,-0.5; 18 2.3,0; 19 2.3,0.5; 20 2.3,1; 21 2.3,1.5 | smd 0.3 x 0.6: 8 -1.5,-2.3; 9 -1,-2.3; 10 -0.5,-2.3; 11 0,-2.3; 12 0.5,-2.3; 13 1,-2.3; 14 1.5,-2.3; 22 1.5,2.3; 23 1,2.3; 24 0.5,2.3; 25 0,2.3; 26 -0.5,2.3; 27 -1,2.3; 28 -1.5,2.3 | smd 3.3 x 3.3: EXP 0,0 | smd 0.435 x 0.435: M -2.103,2.103
SOD2512X116N = smd 1.11 x 0.52: A 1.165,0; K -1.165,0
1X03 = drill 1.016 long: 1 -2.54,0; 2 0,0; 3 2.54,0
ESP07-16PIN = smd 2.5 x 1: ADC -8.2,3.8; CH_PD -8.2,1.8; GND 8.2,-8.105; GPIO0 8.2,-2.2; GPIO2 8.2,-4.2; GPIO4 8.2,1.8; GPIO5 8.2,-0.2; GPIO12 -8.2,-4.2; GPIO13 -8.2,-6.2; GPIO14 -8.2,-2.2; GPIO15 8.2,-6.2; GPIO16 -8.2,-0.2; REST -8.2,5.8; RX 8.2,3.8; TX 8.2,5.8; VCC -8.2,-8.105
JP1 = drill 0.914 long: 1 0,-1.27; 2 0,1.27
R0805 = smd 1.3 x 1.5: 1 -0.95,0; 2 0.95,0
L2012C = smd 1 x 1: 1 -1,0; 2 1,0
CHIPLED_0805 = smd 1.2 x 1.2: A 0,-1.05; C 0,1.05
2,15/1,0 = drill 1.016 pad 2.159 octagon: 1 0,0
QFN50P400X400X95-24N = smd 0.79 x 0.26: 1 -1.97,1.25; 2 -1.97,0.75; 3 -1.97,0.25; 4 -1.97,-0.25; 5 -1.97,-0.75; 6 -1.97,-1.25; 13 1.97,-1.25; 14 1.97,-0.75; 15 1.97,-0.25; 16 1.97,0.25; 17 1.97,0.75; 18 1.97,1.25 | smd 0.26 x 0.79: 7 -1.25,-1.97; 8 -0.75,-1.97; 9 -0.25,-1.97; 10 0.25,-1.97; 11 0.75,-1.97; 12 1.25,-1.97; 19 1.25,1.97; 20 0.75,1.97; 21 0.25,1.97; 22 -0.25,1.97; 23 -0.75,1.97; 24 -1.25,1.97
QFN50P400X400X95-21N = smd 0.81 x 0.26: 1 -1.95,1; 2 -1.95,0.5; 3 -1.95,0; 4 -1.95,-0.5; 5 -1.95,-1; 11 1.95,-1; 12 1.95,-0.5; 13 1.95,0; 14 1.95,0.5; 15 1.95,1 | smd 0.26 x 0.81: 6 -1,-1.95; 7 -0.5,-1.95; 8 0,-1.95; 9 0.5,-1.95; 10 1,-1.95; 16 1,1.95; 17 0.5,1.95; 18 0,1.95; 19 -0.5,1.95; 20 -1,1.95 | smd 2.6 x 2.6: 21 0,0
HC49/S = drill 0.813: 1 -2.413,0; 2 2.413,0
QFN50P300X300X60-17N = smd 0.81 x 0.27: 1 -1.445,0.75; 2 -1.445,0.25; 3 -1.445,-0.25; 4 -1.445,-0.75; 9 1.445,-0.75; 10 1.445,-0.25; 11 1.445,0.25; 12 1.445,0.75 | smd 0.27 x 0.81: 5 -0.75,-1.445; 6 -0.25,-1.445; 7 0.25,-1.445; 8 0.75,-1.445; 13 0.75,1.445; 14 0.25,1.445; 15 -0.25,1.445; 16 -0.75,1.445 | smd 1.7 x 1.7: 17 0,0
SOT23-EBC = smd 1 x 1.4: B 0.95,-1.1; C 0,1.1; E -0.95,-1.1
LQFP48-7X7MM = smd 1.194 x 0.305: 1 -4.25,2.75; 2 -4.25,2.25; 3 -4.25,1.75; 4 -4.25,1.25; 5 -4.25,0.75; 6 -4.25,0.25; 7 -4.25,-0.25; 8 -4.25,-0.75; 9 -4.25,-1.25; 10 -4.25,-1.75; 11 -4.25,-2.25; 12 -4.25,-2.75; 25 4.25,-2.75; 26 4.25,-2.25; 27 4.25,-1.75; 28 4.25,-1.25; 29 4.25,-0.75; 30 4.25,-0.25; 31 4.25,0.25; 32 4.25,0.75; 33 4.25,1.25; 34 4.25,1.75; 35 4.25,2.25; 36 4.25,2.75 | smd 0.305 x 1.194: 13 -2.75,-4.25; 14 -2.25,-4.25; 15 -1.75,-4.25; 16 -1.25,-4.25; 17 -0.75,-4.25; 18 -0.25,-4.25; 19 0.25,-4.25; 20 0.75,-4.25; 21 1.25,-4.25; 22 1.75,-4.25; 23 2.25,-4.25; 24 2.75,-4.25; 37 2.75,4.25; 38 2.25,4.25; 39 1.75,4.25; 40 1.25,4.25; 41 0.75,4.25; 42 0.25,4.25; 43 -0.25,4.25; 44 -0.75,4.25; 45 -1.25,4.25; 46 -1.75,4.25; 47 -2.25,4.25; 48 -2.75,4.25
SOT223 = smd 1.219 x 2.235: 1 -2.311,-3.099; 2 0,-3.099; 3 2.311,-3.099 | smd 3.6 x 2.2: 4 0,3.099
PHB_1MM27_2X07_SNS = smd 0.76 x 2.8: 1 -3.81,-1.85; 2 -3.81,1.85; 3 -2.54,-1.85; 4 -2.54,1.85; 5 -1.27,-1.85; 6 -1.27,1.85; 7 0,-1.85; 8 0,1.85; 9 1.27,-1.85; 10 1.27,1.85; 11 2.54,-1.85; 12 2.54,1.85; 13 3.81,-1.85; 14 3.81,1.85
BU-SMA-G = drill 1.27: 1 0,0 | drill 1.778: 2 -2.55,2.55; 3 2.55,2.55; 4 2.55,-2.55; 5 -2.55,-2.55
32005-301 = smd 3.1 x 0.5: 1 3,1.6; 2 3,0.8; 3 3,0; 4 3,-0.8; 5 3,-1.6 | smd 2.5 x 2: M1 -3,-4.45; M2 -3,4.45 | smd 3.3 x 2: M3 2.9,4.45; M4 2.9,-4.45 | hole 0.9: 0,2.2; 0,-2.2

### Placement (x,y rotation side)
BME280  52.53,53.97 180 top
C1  54,44.84 90 top
C2  37.73,30.04 270 top
C3  47.56,44.28 90 top
C4  51.97,44.27 90 top
C5  49.82,44.29 90 top
C6  35.76,30.28 270 top
C7  39.27,45.55 270 top
C8  33.57,39.17 270 top
C9  33.61,30.26 90 top
C10  37.16,45.54 270 top
C11  14.04,37.47 180 bottom
C12  24.12,32.93 0 bottom
C13  22.15,11.76 270 top
C14  19.8,11.78 270 top
C15  59.74,26 135 top
C16  61.23,27.53 135 top
C17  64.99,20.22 225 top
C18  63.46,14.28 135 top
C19  66.51,17.32 135 top
C20  64.96,15.8 135 top
C21  59.17,11.34 45 top
C22  53.13,34.97 315 top
C23  45.56,28.86 315 top
C24  51.58,33.46 315 top
C25  47.67,24.12 315 top
C26  44.09,27.36 315 top
C27  58.23,23.03 225 top
C28  53.57,18.29 45 top
C29  52.16,21.43 135 top
C30  50.62,19.91 135 top
C31  25.55,62.27 135 top
C32  23.96,60.65 135 top
C33  25.56,56.1 135 top
C34  24.46,54.21 315 top
C35  47.66,50.77 90 top
C36  39.26,49.7 90 top
C37  35.1,49.72 90 top
C38  37.19,49.72 90 top
C41  55.19,50.76 90 top
C42  57.32,50.76 90 top
C45  14.73,21.92 180 top
CP2102  18.13,57.41 135 top
D1  21.5,65.01 135 top
ESC-1  33,13 0 top
ESC-2  43,13 0 top
ESC-3  33,62 0 top
ESC-4  43,62 0 top
ESP8266  17,37.5 90 top
ESP-ENABLE  21.05,25.13 270 top
ESP-MCU-RX  62.29,39.02 0 top
ESP-MCU-TX  59,38.97 0 top
FERRIT  18.25,64.8 315 top
L1  62.01,17.18 225 top
L2  59.11,14.28 225 top
L4  55.22,24.43 315 top
L5  53.73,22.93 135 top
L6  56.73,25.9 315 top
LED1  31.23,45.72 0 top
LED2  28.37,45.72 0 top
LED3  31.58,21.44 0 top
LED4  28.19,21.45 0 top
LIPO+  11.24,5.51 45 top
LIPO-  7.04,8.6 45 top
MPU6050  43.12,54.22 270 top
NRF24L01  51.56,28.08 315 top
Q2  29.79,35.8 90 top
Q3  43.83,22.41 135 top
R1  11.63,53.03 135 top
R2  24.09,42.01 180 bottom
R3  35.07,45.54 270 top
R4  33.6,34.33 90 top
R5  14.12,35.19 180 bottom
R6  18.24,42.01 0 bottom
R7  22.17,39.59 180 bottom
R8  16.15,32.95 180 bottom
R9  13.16,54.55 315 top
R10  18.79,50.3 135 top
R11  20.36,51.81 135 top
R12  22.51,59.05 315 top
R13  57.64,15.75 45 top
R14  58.26,28.88 225 top
R15  56.17,17.23 45 top
R17  14.03,8.23 45 top
R18  10.31,11.95 225 top
R19  49.87,57.61 90 top
R20  47.71,57.6 90 top
R21  49.84,50.75 270 top
R22  55.17,57.56 270 top
R23  39.5,21.52 315 top
R24  31.23,49.79 90 top
R25  28.35,49.8 90 top
R26  31.56,25.61 90 top
R27  28.18,25.62 90 top
R50  16.62,61.79 225 top
RFX2401C  60.47,20.48 315 top
T3  15.34,50.89 225 top
T4  9.59,56.76 45 top
U1  42,37.5 0 top
U4  19.8,18.81 0 top
USB-PWR  13.93,59.09 135 top
X1  62.84,62.97 135 top
X2  66.34,8.57 315 top
X3  9.18,66.4 315 top

### Tracks (layer width: path | path; a pad name or v marks a point on that pad's centre or on a via)
3.3V  (via drill 0.35)
  Top 0.254: CP2102.6 22.36,54.6 22.73,54.6 C34.+ | RFX2401C.16 62.02,23.09 62.02,23.72 C15.1 | RFX2401C.14 63.5,23.16 63.5,25.21 61.9,26.81 61.86,26.85 63.05,28.04 | NRF24L01.7 48.92,26.15 48.27,26.15 C23.2 v47.3,29.25 | NRF24L01.18 55.27,31.8 55.27,32.83 53.86,34.25 | 53.86,34.25 C22.2 | NRF24L01.15 54.21,26.85 54.47,26.85 55.77,28.15 55.77,28.61 v55.36,29.02 | v54.91,35.41 53.86,34.35 53.86,34.25 | U1.1 38.99,40.25 | 38.99,40.25 39.21,40.25 | 39.21,40.25 39.51,40.25 | 39.51,40.25 44.43,40.25 | 44.43,40.25 44.75,40.25 | 44.75,40.25 45.04,40.25 | 45.04,40.25 U1.36 47.19,40.25 47.56,40.62 C3.1 | 44.75,35.94 U1.24 44.75,32.53 44.9,32.38 45.61,32.38 | 44.75,35.94 44.75,36.24 | 44.75,36.24 44.75,36.57 | 44.75,36.57 44.75,39.93 | 44.75,39.93 44.75,40.25 | 44.75,39.93 44.43,40.25 | 44.75,39.93 45.04,40.22 45.04,40.25 | 39.25,40.51 U1.48 39.25,44.59 C7.2 | 39.25,40.51 39.25,40.29 39.21,40.25 | 39.25,40.51 38.99,40.25 | 39.25,40.51 39.51,40.25 | 39.51,40.25 | 44.43,36.25 U1.9 36.37,36.25 35.76,35.64 C6.1 | 44.44,36.25 44.74,36.25 44.75,36.24 | 44.43,36.25 44.75,36.57 | 44.43,36.25 44.44,36.25 | 44.44,36.25 44.75,35.94 | C41.2 55.19,52.61 54.8,53 BME280.8 53.5,50.22 53.08,49.8 52.29,49.8 | BME280.6 57.06,54.3 | 57.32,54.03 C42.2 | 57.32,54.03 57.06,54.3 | C38.2 37.19,53.89 38.27,54.97 39.14,54.97 | v39.17,54.97 MPU6050.8 | C33.2 25.81,57.7 34.37,57.7 35.11,56.96 35.11,56.76 | 35.11,56.76 35.11,56.49 | 35.11,56.49 35.11,56.2 | 35.11,56.2 C37.2 | 57.32,54.03 57.32,54.6 | 57.32,54.6 57.32,59.65 55.97,61 55.16,61 | R19.2 49.87,60.3 50.56,61 54.5,61 | 55.16,61 54.83,61 | 54.83,61 54.5,61 | 57.06,54.3 57.06,54.33 57.32,54.6 | 54.83,61 54.83,61.33
  Top 0.254: 54.83,61.33 54.83,63.87 60.38,69.42 62.54,69.42 67.34,64.62 67.34,63.87 X1.3 | 54.83,61.33 54.5,61 | 54.83,61.33 55.16,61 | R21.2 v52.27,49.8 | 55.6,43.34 C1.+ | 35.11,56.49 35.38,56.49 | 35.4,56.49 39.77,56.49 41.83,58.55 R20.2 | 35.4,56.49 35.38,56.49 | 35.38,56.49 35.11,56.76 | 35.4,56.49 35.11,56.2 | MPU6050.13 41.87,51.48 41.4,51.01 40.91,51.01
  Top 0.305: R3.1 33.56,46.49 32.96,47.09 32.96,50.09 33.54,50.67 C37.2
  Top 0.508: C33.2 23.4,55.29 C34.+ | C15.1 61.9,26.81 C16.1 | 19.8,25.11 U4.4 | U4.4 C45.1 | U4.2 19.8,15.56 | 19.8,15.56 C14.+ | C6.1 35.83,31.3 37.49,31.3 C2.+ 38.77,31.54 39.33,30.98 v39.33,30.06 | C3.1 C5.1 51.95,43.34 C4.1 53.98,43.32 C1.+ | C42.2 C41.2 | C38.2 C37.2 | R20.2 R19.2 | U4.4 19.8,15.56
  Top 0.61: v45.63,32.38 45.61,32.38 | v47.31,29.25 v47.3,29.25 | v55.35,29.03 v55.36,29.02 | v54.92,35.41 v54.91,35.41 | v63.06,28.04 v63.05,28.04 63.05,28.04 | v55.62,43.34 55.6,43.34 | v40.89,51.01 40.91,51.01 | v39.17,54.97 39.14,54.97 | v52.27,49.8 52.29,49.8
  Top 1.27: ESP-ENABLE.1 19.8,25.11
  Bottom 0.254: v63.06,28.05 58.94,32.17 | 58.94,32.17 58.7,32.41 | 58.7,32.41 58.54,32.57 | v54.93,35.41 55.7,35.41 58.46,32.65 58.54,32.57 | v55.35,29.04 58.54,32.23 | 58.54,32.23 58.7,32.38 58.7,32.41 | 58.54,32.23 58.54,32.57 | 58.54,32.23 58.59,32.17 58.94,32.17 | 47.3,29.27 45.63,30.93 v45.63,32.38 | 45.63,32.4 45.63,34.62 46.42,35.41 v54.92,35.41 | 55.62,43.36 55.62,48.44 54.26,49.8 v52.27,49.8 | 40.87,51.01 39.69,51.01 39.17,51.53 39.17,54.95
  Bottom 0.508: 19.78,25.2 19.78,27.53 22.31,30.06 v39.33,30.06
  Bottom 0.61: v47.31,29.25 47.3,29.27 | v45.63,32.38 45.63,32.4 | v54.92,35.41 v54.93,35.41 | v55.35,29.03 v55.35,29.04 | v63.06,28.04 v63.06,28.05 | v55.62,43.34 55.62,43.36 | v40.89,51.01 40.87,51.01 | v39.17,54.97 39.17,54.95
  Bottom 1.27: ESP-ENABLE.1 19.78,25.2
5V  (via drill 0.35)
  Top 0.305: 52.8,56.84 52.7,56.95 52.7,59.72
  Top 0.508: D1.K 21.32,63.18 v21.29,63.18 | U4.3 22.15,15.67 C13.+ 24.19,13.26 v24.22,13.23 | v25.72,58.73 34.67,58.73 35.54,59.6 35.54,59.61 | 35.54,59.61 35.54,59.91 | 35.54,61.91 35.54,60.26 | 35.54,60.26 35.54,59.91 | 35.54,59.91 35.84,59.91 | 35.89,59.91 44.94,59.91 45.54,60.51 45.54,61.9 | 35.89,59.91 35.54,60.26 | 35.89,59.91 35.84,59.91 | 35.84,59.91 35.54,59.61
  Top 0.61: v52.82,56.83 52.8,56.84 | v52.7,59.74 52.7,59.72
  Top 1.27: ESC-3.3 35.54,61.91 | ESC-4.3 45.54,61.9
  Bottom 0.305: ESC-2.3 55.01,13 64.51,22.5 64.51,28.4 56.71,36.2 56.71,51.56 52.82,55.45 52.82,56.8 | 52.7,59.76 52.7,61.36 52.06,62 ESC-4.3
  Bottom 0.508: v25.72,58.73 25.72,58.75 v21.29,63.18 | v24.22,13.23 24.22,14.93 25.77,16.48 35.04,16.48 | 45.54,13.1 45.54,15.67 44.73,16.48 36.04,16.48 | 35.04,16.48 35.67,16.48 | 35.67,16.48 36.04,16.48 | ESC-1.3 35.54,15.98 | 35.54,15.98 35.54,16.35 35.67,16.48 | 35.54,15.98 35.04,16.48 | 35.54,15.98 36.04,16.48
  Bottom 0.61: v52.82,56.83 52.82,56.8 | v52.7,59.74 52.7,59.76
  Bottom 1.27: ESC-4.3 | ESC-1.3 | ESC-2.3 45.54,13.1
BOOT0  (via drill 0.35)
  Top 0.254: U1.44 41.25,44.27 v40.97,44.55 | 25.9,35.66 22.59,35.66 21.2,34.27 ESP8266.GPIO12
  Top 0.61: v40.96,44.56 v40.97,44.55 | v25.92,35.66 25.9,35.66
  Bottom 0.254: 40.98,44.55 42.06,43.46 42.06,37.04 40.68,35.66 v25.93,35.66
  Bottom 0.61: v25.92,35.66 v25.93,35.66 | v40.96,44.56 40.98,44.55
CH_PD  (via drill 0.35)
  Top 0.305: 15.2,31.27 ESP8266.CH_PD
  Top 0.61: v15.2,31.29 | v15.2,31.29 15.2,31.27
  Bottom 0.305: 15.2,31.32 R8.1
  Bottom 0.61: v15.2,31.29 15.2,31.32
DTR  (via drill 0.35)
  Top 0.254: v16.79,53.95 CP2102.28 | 9.91,52.66 R1.2
  Top 0.508: T4.E 9.69,54.97 R1.2
  Top 0.61: v9.89,52.63 9.91,52.66 | v16.79,53.95
  Bottom 0.254: v9.89,52.63 13.21,55.95 14.79,55.95 16.77,53.97
  Bottom 0.61: v16.79,53.95 16.77,53.97 | v9.89,52.63
E-3.3V  (via drill 0.35)
  Top 0.305: 25.11,31.3 ESP8266.VCC
  Top 0.508: 22.36,25.13 24.1,25.13 25.11,26.14 ESP8266.VCC
  Top 0.61: v25.12,31.31 25.11,31.3
  Top 1.27: ESP-ENABLE.2 22.36,25.13
  Bottom 0.305: 25.12,31.34 25.12,32.88 | 25.12,32.88 C12.1 | R7.2 24.34,39.59 25.12,38.81 25.12,38.22 | 25.12,38.22 25.12,37.81 | 25.12,37.81 25.12,37.41 | 25.12,37.41 25.12,35.58 | 25.12,35.58 25.12,35.07 | 25.12,35.07 25.12,34.6 | 25.12,34.6 25.12,32.88 | 25.12,35.07 24.61,35.07 | 24.61,35.07 17.51,35.07 | 17.51,35.07 17.05,35.07 | 17.05,35.07 16.76,35.07 | 16.76,35.07 15.19,35.07 R5.2 | R8.2 17.1,34.73 | 17.1,34.73 17.1,35.02 17.05,35.07 | 16.76,35.07 17.1,34.73 | 17.1,34.73 17.17,34.73 17.51,35.07 | 25.12,35.58 24.61,35.07 | 24.61,35.07 25.08,34.6 25.12,34.6 | R6.2 17.29,38.35 17.83,37.81 24.71,37.81 | 24.72,37.81 25.12,37.81 | 24.71,37.81 25.12,38.22 | 24.71,37.81 24.72,37.81 | 24.72,37.81 25.12,37.41
  Bottom 0.61: v25.12,31.31 25.12,31.34
ESP-LED-1
  Top 0.305: ESP8266.GPIO4 15.2,42.55 16.88,40.87 30.08,40.87 31.23,42.02 LED1.A
ESP-LED-2
  Top 0.305: ESP8266.GPIO5 17.2,42.66 17.71,42.15 27.82,42.15 28.37,42.7 LED2.A
GND  (via drill 0.35)
  Top 0.254: CP2102.3 18.13,56.7 CP2102.EXP | RFX2401C.3 60.12,20.48 RFX2401C.17 60.82,20.48 RFX2401C.11 | NRF24L01.14 52.27,28.09 NRF24L01.21
  other vias: 61.07,33.67 60.62,43.15 56.95,32.66 43.12,54.89 39.87,38.55 41.02,38.57 34.05,25.89 55.19,60.16 55.61,41.16 52.25,51.26 31.21,52.98 40.86,46.5 47.56,30.44 54.29,32.15 52.8,31.25 43.19,38.65 45.82,43.15 58.74,58.27 58.6,55.07 57.95,30.58
  pour Top: -17,81 91.21,81 91.21,-12 -17,-12
  pour Bottom: -26,83 94,83 94,68 94,-18 76,-18 -26,-18
GPIO0  (via drill 0.35)
  Top 0.305: v19.2,43.7 ESP8266.GPIO0 | T4.C 10.05,58.78 v10.82,58.78
  Top 0.61: v19.19,43.69 v19.2,43.7 | v10.83,58.78 v10.82,58.78
  Bottom 0.305: v19.19,43.68 R6.1 | 10.85,58.8 11.86,59.81 13.07,59.81 18.41,54.47 18.41,53.69 17.28,52.56 17.28,43.97 17.56,43.69 v19.19,43.69
  Bottom 0.61: v10.83,58.78 10.85,58.8 | v19.19,43.69 v19.19,43.68
GPIO2  (via drill 0.35)
  Top 0.305: v21.23,43.81 21.23,45.67 ESP8266.GPIO2
  Top 0.508: ESP8266.GPIO2
  Top 0.61: v21.23,43.8 v21.23,43.81
  Bottom 0.305: 21.22,43.79 R7.1
  Bottom 0.61: v21.23,43.8 21.22,43.79
GPIO15  (via drill 0.35)
  Top 0.305: 23.18,45.68 23.15,45.65 23.15,43.79
  Top 0.508: ESP8266.GPIO15 23.18,45.68
  Top 0.61: v23.15,43.76 23.15,43.79
  Bottom 0.305: 23.15,43.73 R2.1
  Bottom 0.61: v23.15,43.76 23.15,43.73
N$1
  Top 0.254: CP2102.9 21.84,59.71 R12.1
N$2  (via drill 0.35)
  Top 0.254: 22.92,53.94 22.31,53.94 CP2102.5
  Top 0.305: 14.6,62.1 X3.2
  Top 0.61: v22.96,53.94 22.92,53.94 | v14.6,62.08 14.6,62.1
  Bottom 0.254: v14.61,62.07 22.74,53.94 v22.95,53.94
  Bottom 0.61: v14.6,62.08 v14.61,62.07 | v22.96,53.94 v22.95,53.94
N$3
  Top 0.305: X3.1 14.2,63.64 15.74,63.64 FERRIT.1
N$4  (via drill 0.35)
  Top 0.254: 23.59,53.27 22.27,53.27 CP2102.4
  Top 0.305: 13.56,62.01 X3.3
  Top 0.61: v23.62,53.27 23.59,53.27 | v13.58,62.01 13.56,62.01
  Bottom 0.254: v13.59,62 22.32,53.27 23.6,53.27
  Bottom 0.61: v13.58,62.01 v13.59,62 | v23.62,53.27 23.6,53.27
N$5
  Top 0.508: 29.85,33.39 R4.1 33.62,33.36 33.62,31.22 C9.2
  Top 1.27: Q2.1 29.85,33.39
N$6
  Top 0.254: RFX2401C.6 58.39,18.75 58.39,18.48 59.22,17.65 59.22,17.33 R13.2
N$7
  Top 0.254: RFX2401C.5 56.84,17.91 R15.2
N$8
  Top 0.254: RFX2401C.10 L1.1
  Top 0.508: L1.1 64.32,19.48 C17.2 64.32,19.51 C19.2
N$9
  Top 0.508: L2.1 61.3,16.47 L1.2 62.78,14.99 | 62.78,14.99 C18.2 | C20.2 62.81,14.99 62.78,14.99
N$10
  Top 0.254: NRF24L01.10 C25.2 | C25.2
  Top 0.508: 45.56,20.73 48.29,23.45 C25.2
  Top 1.27: Q3.1 45.56,20.73
N$11
  Top 0.508: L2.2 58.4,13.46 C21.2 60.86,13.03 61.88,13.03 X2.1
  Top 2: X2.1
N$12
  Top 0.508: 11.31,5.51 R17.1
  Top 1.27: LIPO+.1 11.31,5.51
N$13
  Top 0.508: R18.2 9.64,11.2 7.09,8.64
  Top 1.27: LIPO-.1 7.09,8.64
N$14
  Top 0.508: R24.1 LED1.C
N$15
  Top 0.254: NRF24L01.9 49.47,25.29 48.42,25.29 47.17,26.54 46.62,26.54 45.95,25.87 45.58,25.87 C26.2
  Top 0.508: 42.17,24.15 44.7,26.69 C26.2
  Top 1.27: Q3.2 42.17,24.15
N$16
  Top 0.254: NRF24L01.16 54.58,29.69 56.11,29.69 R14.2
N$17
  Top 0.508: R25.1 28.37,48.83 LED2.C
N$19
  Top 0.254: NRF24L01.13 L4.1
  Top 0.508: L4.1 55.99,26.61 L6.1
N$20
  Top 0.254: NRF24L01.12 53.27,25.67 53.27,24.87 54.96,23.18 | 54.96,23.18 55.18,22.96 | 54.96,22.75 54.96,23.18 | 54.96,23.18 54.97,23.18 55.4,23.18
  Top 0.508: L4.2 55.4,23.18 55.18,22.96 54.96,22.75 L5.1
N$21
  Top 0.508: C27.1 57.43,25.17 L6.2
N$22
  Top 0.254: NRF24L01.19 53.47,30.7 53.47,31.58 C24.2
N$23
  Top 0.508: R26.1 31.56,22.51 LED3.C
N$24
  Top 0.508: R27.1 LED4.C
N$26
  Top 0.254: MPU6050.10 39.71,53.97 39.26,53.52 C36.2
N$27
  Top 0.254: MPU6050.20 47.15,53.47 47.66,52.95 C35.2
N$29
  Top 0.508: R1.1 12.54,52.35 T3.B
N$30
  Top 0.254: R21.1 49.84,53.35 50.14,53.65 BME280.2
N$31
  Top 0.254: BME280.5 54.63,54.95 55.17,55.49 R22.2
N$32
  Top 0.508: T4.B 12.46,55.23 R9.1
N$44
  Top 0.508: USB-PWR.A 15.95,61.11 R50.2
NRF-ANT
  Top 0.254: RFX2401C.4 57.61,22.28 57.56,22.28
  Top 0.508: C28.2 57.56,22.28 C27.2
NRST  (via drill 0.35)
  Top 0.254: U1.7 35.78,37.25 35.64,37.11 | 33.46,44.59 R3.2 | ESP8266.GPIO13 23.2,33.32 24.45,34.57 27.36,34.57 29.51,36.72 v33.44,36.72 | X1.12 57.75,61.47 57.75,53.71 58.69,52.77 58.69,48.69 58.44,48.44 44.69,48.44 v43.95,47.7
  Top 0.508: R3.2 C10.2
  Top 0.61: v43.94,47.69 v43.95,47.7 | v33.45,44.58 33.46,44.59 | v33.45,36.72 v33.44,36.72 | v35.63,37.09 35.64,37.11
  Bottom 0.254: 35.59,37.09 33.77,37.09 | 33.77,37.09 33.49,37.09 33.45,37.13 | 33.45,37.13 33.45,37.41 | 33.45,37.41 33.45,41.83 | 33.45,41.83 33.45,42.17 | 33.45,42.17 33.45,42.5 | 33.45,44.56 33.45,42.5 | 33.45,36.77 33.45,37.13 | 33.45,37.41 33.77,37.09 | 33.77,37.09 33.45,36.77 | 33.45,36.77 33.45,36.75 | 43.9,47.69 40.42,47.69 39.57,46.84 39.57,44.75 41.2,43.12 41.2,42.52 40.86,42.18 33.77,42.18 | 33.45,42.17 33.46,42.18 33.77,42.18 | 33.77,42.18 33.45,42.5 | 33.77,42.18 33.77,42.15 33.45,41.83
  Bottom 0.61: v33.45,36.72 33.45,36.75 | v35.63,37.09 35.59,37.09 | v43.94,47.69 43.9,47.69 | v33.45,44.58 33.45,44.56
OSC_IN
  Top 0.254: U1.5 33.6,38.25 C8.2
  Top 0.508: 29.83,38.21 C8.2
  Top 1.27: Q2.2 29.83,38.21
OSC_OUT
  Top 0.254: R4.2 34.82,35.28 34.97,35.43 34.97,37.48 35.24,37.75 U1.6
PA1-LIPO-IN  (via drill 0.35)
  Top 0.254: U1.11 36.91,35.25 36.51,34.85 36.51,34.07 | v9.77,13.84 10.97,12.63 R18.1
  Top 0.508: R17.2 R18.1
  Top 0.61: v36.51,34.04 36.51,34.07 | v9.76,13.84 v9.77,13.84
  Bottom 0.254: 36.56,34.04 38.7,34.04 40.2,32.54 40.2,28.12 35.15,23.07 14.49,23.07 9.76,18.34 v9.76,13.85
  Bottom 0.61: v36.51,34.04 36.56,34.04 | v9.76,13.84 v9.76,13.85
PA6-LED-1
  Top 0.254: U1.16 40.75,29.45 35.71,24.41 35.71,21.73 36.39,21.06 36.39,19.87 34.89,18.37 32.03,18.37 31.58,18.82 LED3.A
PA7-LED-2
  Top 0.254: U1.17 41.25,29.38 36.12,24.24 36.12,21.9 36.84,21.18 36.84,19.75 33.77,16.67 29.22,16.67 28.19,17.7 LED4.A
PA8-RF-TXEN  (via drill 0.35)
  Top 0.254: U1.29 50.62,36.75 50.91,36.45 | 54.4,15.46 R15.1
  Top 0.61: v54.38,15.44 54.4,15.46 | v50.93,36.44 50.91,36.45
  Bottom 0.254: v50.94,36.44 55.59,36.44 63.91,28.12 63.91,24.97 v54.39,15.45
  Bottom 0.61: v54.38,15.44 v54.39,15.45 | v50.93,36.44 v50.94,36.44
PA9-TX
  Top 0.254: U1.30 54.6,37.25 56.53,35.32 61.56,35.32 62.29,36.05 62.29,37.71
  Top 1.27: ESP-MCU-RX.1 62.29,37.71
PA10-RX
  Top 0.254: U1.31 54.9,37.75 56.66,35.99 58.55,35.99 59,36.44 59,37.68
  Top 1.27: ESP-MCU-TX.1 59,37.68
PB0-PWM-3
  Top 0.254: U1.18 41.75,29.3 36.52,24.07 36.52,22.07 37.27,21.32 37.27,19.6 33,15.33 33,13.06
  Top 1.27: ESC-1.2 33,13.06
PB1-PWM-4
  Top 0.254: U1.19 42.25,29.22 36.93,23.9 36.93,22.24 43,16.17 ESC-2.2
  Top 1.27: ESC-2.2
PB2-BOOT1
  Top 0.254: U1.20 42.75,29.12 37.55,23.92 37.55,23.47 R23.1
PB4-PWM-1  (via drill 0.35)
  Top 0.254: U1.40 43.25,48.13 v43.77,48.65
  Top 0.61: v43.77,48.65
  Bottom 0.254: v43.76,48.65 39.19,48.65 37.97,49.87 37.97,58.89 37.23,59.63 33.4,59.63 33,60.03 33,61.86
  Bottom 0.61: v43.77,48.65 v43.76,48.65
  Bottom 1.27: ESC-3.2 33,61.86
PB5-PWM-2  (via drill 0.35)
  Top 0.254: U1.41 42.75,48.98 v43.12,49.35
  Top 0.61: v43.13,49.36 v43.12,49.35
  Bottom 0.254: 43.1,49.36 39.29,49.36 38.51,50.14 38.51,58.7 39.35,59.54 42.56,59.54 43,59.98 43,61.89
  Bottom 0.61: v43.13,49.36 43.1,49.36
  Bottom 1.27: ESC-4.2 43,61.89
PB6-I2C-SCL  (via drill 0.35)
  Top 0.254: v42.25,50.83 U1.42 | v50.06,54.97 50.23,54.97 | 50.23,54.97 51.54,54.97 BME280.4 | MPU6050.23 49.47,54.97 | 49.47,54.97 49.86,54.97 | v50.06,54.97 49.86,54.97 | R19.1 49.87,55.36 | 49.87,55.36 49.87,54.97 49.86,54.97 | 49.87,55.36 49.47,54.97 | 49.87,55.36 50.23,54.99 50.23,54.97
  Top 0.61: v50.06,54.97 | v42.25,50.83
  Bottom 0.254: 42.25,50.85 42.25,56.84 42.7,57.29 49.71,57.29 50.06,56.94 50.06,55
  Bottom 0.61: v42.25,50.83 42.25,50.85 | v50.06,54.97 50.06,55
PB7-I2C-SDA  (via drill 0.35)
  Top 0.254: MPU6050.24 47.41,55.47 47.71,55.77 R20.1 | R20.1 | 49.23,54.3 BME280.3 | 46.23,56.65 R20.1 | U1.43 41.75,49.83 v41.55,50.03
  Top 0.61: v41.54,50.04 v41.55,50.03 | v46.21,56.63 46.23,56.65 | v49.22,54.31 49.23,54.3
  Bottom 0.254: v49.22,54.32 49.22,56.26 48.85,56.63 46.26,56.63 | 41.57,50.04 42.77,50.04 43.85,51.12 43.85,55.9 44.58,56.63 v46.21,56.63
  Bottom 0.61: v41.54,50.04 41.57,50.04 | v46.21,56.63 46.26,56.63 | v49.22,54.31 v49.22,54.32
PB8-MEMS-INT  (via drill 0.35)
  Top 0.254: 39.95,52.97 MPU6050.12 | v36.53,53.01 36.53,54.34 37.94,55.75 39.88,55.75 | U1.45 40.75,42.77 40.47,43.05 v40.03,43.05
  Top 0.61: v39.93,52.99 39.95,52.97 | v39.92,55.75 39.88,55.75 | v36.53,53 v36.53,53.01 | v40.02,43.05 v40.03,43.05
  Bottom 0.254: v39.93,55.74 v39.93,53 | v40.01,43.05 37.32,43.05 36.53,43.84 36.53,52.97
  Bottom 0.61: v40.02,43.05 v40.01,43.05 | v39.93,52.99 v39.93,53 | v39.92,55.75 v39.93,55.74 | v36.53,53 36.53,52.97
PB10-NRF-IRQ  (via drill 0.35)
  Top 0.254: NRF24L01.6 48.8,26.74 48.6,26.74 v47.89,27.45 | 44.02,30.98 43.57,30.98 43.25,31.3 U1.21
  Top 0.61: v44.04,30.98 44.02,30.98 | v47.89,27.46 v47.89,27.45
  Bottom 0.254: v47.88,27.47 44.37,30.98 v44.05,30.98
  Bottom 0.61: v44.04,30.98 v44.05,30.98 | v47.89,27.46 v47.88,27.47
PB11-NRF-CE  (via drill 0.35)
  Top 0.254: NRF24L01.1 50.08,30.98 50.08,31.37 50.8,32.09 | v47.59,31.61 44.46,31.61 43.75,32.32 U1.22
  Top 0.61: v47.6,31.61 v47.59,31.61 | v50.81,32.1 50.8,32.09
  Bottom 0.254: v47.61,31.61 50.33,31.61 v50.81,32.09
  Bottom 0.61: v47.6,31.61 v47.61,31.61 | v50.81,32.1 v50.81,32.09
PB12-NRF-CS  (via drill 0.35)
  Top 0.254: U1.25 47.21,34.75 47.45,34.51 47.45,33.57 47.21,33.33 46.57,33.33 | NRF24L01.2 49.56,30.79 49.56,32.13 v50.23,32.8 v50.23,32.81
  Top 0.61: v46.55,33.33 46.57,33.33 | v50.24,32.81 v50.23,32.81
  Bottom 0.254: 46.57,33.33 47.85,33.33 48.82,34.3 49.94,34.3 50.24,34 50.24,32.83
  Bottom 0.61: v46.55,33.33 46.57,33.33 | v50.24,32.81 50.24,32.83
PB13-SPI-SCK  (via drill 0.35)
  Top 0.254: U1.26 47.62,35.25 47.89,34.98 47.89,32.97 47.34,32.42 46.61,32.42 | 49.55,33.44 49.16,33.04 49.16,30.49 NRF24L01.3
  Top 0.61: v46.59,32.42 46.61,32.42 | v49.57,33.45 49.55,33.44
  Bottom 0.254: 46.61,32.42 48.54,32.42 v49.56,33.44
  Bottom 0.61: v46.59,32.42 46.61,32.42 | v49.57,33.45 v49.56,33.44
PB14-SPI-MISO
  Top 0.254: U1.27 47.96,35.75 48.34,35.37 48.34,29.89 NRF24L01.5
PB15-SPI-MOSI
  Top 0.254: NRF24L01.4 48.75,30.19 48.75,35.68 48.18,36.25 U1.28
RESET  (via drill 0.35)
  Top 0.305: T3.C 15.23,49.22 11.17,49.22 10.66,48.71 | ESP8266.REST 11.2,31.62 12.46,32.88 v13.16,32.88
  Top 0.61: v10.64,48.69 10.66,48.71 | v13.17,32.88 v13.16,32.88
  Bottom 0.305: 10.65,48.67 13.17,46.16 13.17,37.39 13.17,35.5 | R5.1 13.17,35.5 | 13.17,32.9 13.17,35.5
  Bottom 0.508: 13.17,37.39 C11.1
  Bottom 0.61: v10.64,48.69 10.65,48.67 | v13.17,32.88 13.17,32.9
RTS
  Top 0.254: CP2102.24 13.89,53.88 R9.2
  Top 0.508: R9.2 15.24,52.48 T3.E
RX  (via drill 0.35)
  Top 0.305: ESP8266.RX 13.2,47.37 13.48,47.65 20.14,47.65 22.15,49.66 v22.15,49.76 | R11.1 22.15,50.02 22.15,49.81 | 36.85,58.7 39.95,58.7
  Top 0.61: v39.97,58.7 39.95,58.7 | v36.82,58.67 36.85,58.7 | v22.15,49.76 22.15,49.81
  Bottom 0.305: 62.29,40.31 62.29,53 56.59,58.7 39.99,58.7 | 36.8,58.67 31.06,58.67 v22.16,49.77
  Bottom 0.61: v22.15,49.76 v22.16,49.77 | v36.82,58.67 36.8,58.67 | v39.97,58.7 39.99,58.7
  Bottom 1.27: ESP-MCU-RX.2 62.29,40.31
RXD
  Top 0.254: CP2102.25 15.42,54.7 15.42,53.67 R10.2
SWCLK
  Top 0.254: U1.37 44.75,46.42 45.9,47.57 59.3,47.57 60.58,48.85 60.58,58.91 X1.6
SWDIO
  Top 0.254: U1.34 56.19,39.25 56.87,39.93 56.87,44.44 61.02,48.59 61.02,57.9 62.98,59.86 X1.4
SWO
  Top 0.254: U1.39 43.75,46.47 45.3,48.02 59.17,48.02 60.11,48.95 60.11,60.23 X1.8
TX  (via drill 0.35)
  Top 0.305: ESP8266.TX 11.2,47.54 12.01,48.35 18.18,48.35 v18.33,48.5 | v18.34,48.51 R10.1 | v36.87,57.76 v39.94,57.76
  Top 0.61: v39.95,57.75 v39.94,57.76 | v36.86,57.75 v36.87,57.76 | v18.34,48.51 v18.33,48.5
  Bottom 0.305: 59,40.26 59,52.87 54.12,57.75 39.97,57.75 | 36.83,57.75 32.21,57.75 22.97,48.51 18.36,48.51
  Bottom 0.61: v18.34,48.51 18.36,48.51 | v36.86,57.75 36.83,57.75 | v39.95,57.75 39.97,57.75
  Bottom 1.27: ESP-MCU-TX.2 59,40.26
TXD
  Top 0.254: CP2102.26 15.9,54.47 15.9,53.85 17.08,52.67 17.7,52.67 18.39,53.36 18.81,53.36 R11.2
VBUS
  Top 0.254: CP2102.7 21.11,56.56 21.37,56.56 22.07,57.27 | 22.07,57.27 22.25,57.45 | 22.25,57.45 22.43,57.62 | 22.43,57.62 R12.2 | CP2102.8 21.17,58.33 21.37,58.33 22.07,57.62 | 22.07,57.62 22.25,57.45 | 22.07,57.62 22.43,57.62 | 22.07,57.62 22.07,57.27 | D1.A 21.37,66.53 21.72,66.53 23.71,64.54 25.39,64.54 26.99,62.94 26.99,62.36 C31.1
  Top 0.508: R50.1 18.92,64.09 FERRIT.2 20.62,65.83 D1.A | R12.2 24.63,59.83 C32.1 26.23,61.57 C31.1
VDD_PA
  Top 0.254: NRF24L01.11 52.78,25.45 52.78,25.1 52.35,24.67 52.35,24.31 L5.2 | C30.2 48.98,19.61 48.98,18.63 53.65,13.96 55.85,13.96 R13.1
  Top 0.508: L5.2 C29.2 49.97,20.58 C30.2

### Text on the board
tPlace: GND | PWM | 5V | GND | PWM | 5V | Designed By / Turgay H. | Referance By / Y. Emre H. | Fincance By / Berkay H. | GND | PWM | 5V | GND | PWM | 5V